# Altium project PC104-M7.PrjPcb (part 1 of 2)
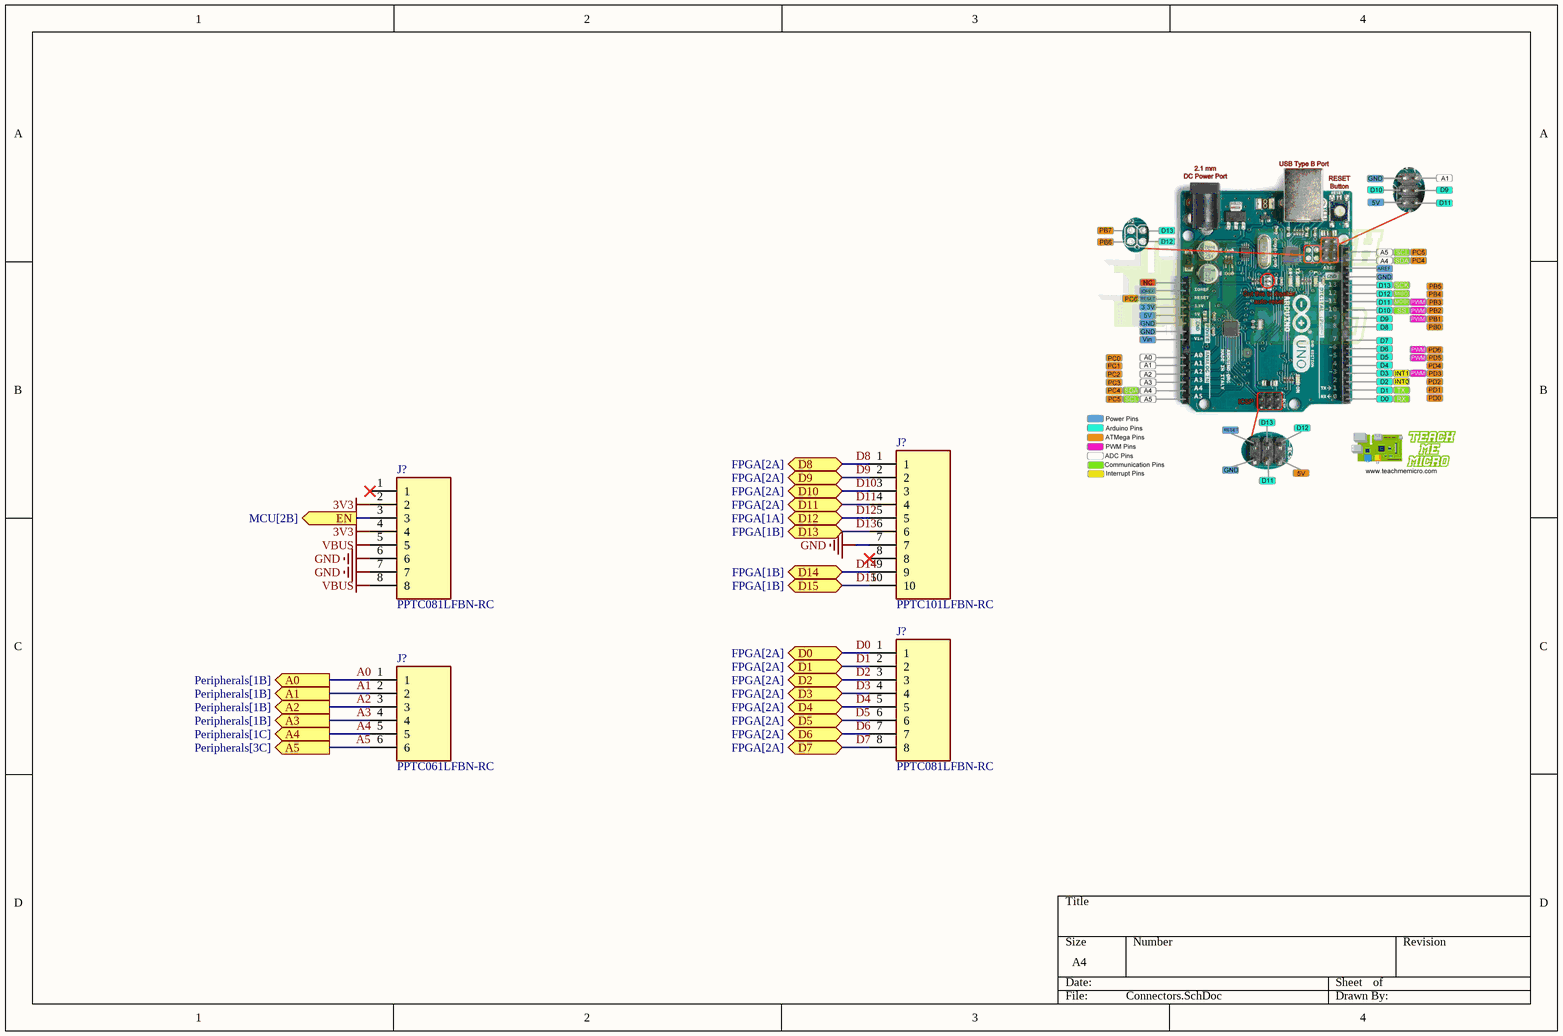
[diagram p0: Connectors.SchDoc]
13 sheets, 147 parts. Net scope: flat (ports and power ports of the same name join across sheets).
Board files: BoardTemplate.PcbDoc, PC104_M7_4L.PcbDoc, PC104-M7_6L.PcbDoc
Sheets:
  Connectors.SchDoc
  GENERAL.SchDoc
    Designator = MCU.SchDoc
    Designator = CAN.SchDoc
    Designator = RS485.SchDoc
    Designator = MemoryStorage.SchDoc
    Designator = TempSensors.SchDoc
    Designator = ExternalConnectors.SchDoc
    Designator = BoardConnectors.SchDoc
    Designator = FPGA.SchDoc
    Designator = RF.SchDoc
    Designator = Power.SchDoc
    Designator = AOCS.SchDoc

## Sheet Connectors.SchDoc
size A4; SheetNumber: 7; SheetTotal: 7

### Parts
(Parts that share a designator on the sheet are numbered #1, #2 ... from top to bottom, then left to right.)
J?#1  PPTC101LFBN-RC  [RHDR10W80P0X254_1X10_2590X254X850P]
J?#2  PPTC081LFBN-RC  [RHDR8W80P0X254_1X8_2082X254X850P]
J?#3  PPTC081LFBN-RC  [RHDR8W80P0X254_1X8_2082X254X850P]
J?#4  PPTC061LFBN-RC  [RHDR6W80P0X254_1X6_1574X254X870P]

### Ports
A0 (out, see Peripherals[1B]), A1 (out, see Peripherals[1B]), A2 (out, see Peripherals[1B]), A3 (out, see Peripherals[1B]), A4 (out, see Peripherals[1C]), A5 (out, see Peripherals[3C]), D0 (bidir, see FPGA[2A]), D1 (bidir, see FPGA[2A]), D2 (bidir, see FPGA[2A]), D3 (bidir, see FPGA[2A]), D4 (bidir, see FPGA[2A]), D5 (bidir, see FPGA[2A]), D6 (bidir, see FPGA[2A]), D7 (bidir, see FPGA[2A]), D8 (bidir, see FPGA[2A]), D9 (bidir, see FPGA[2A]), D10 (bidir, see FPGA[2A]), D11 (bidir, see FPGA[2A]), D12 (bidir, see FPGA[1A]), D13 (bidir, see FPGA[1B]), D14 (bidir, see FPGA[1B]), D15 (bidir, see FPGA[1B]), EN (out, see MCU[2B])

### Nets
3V3: J?#2.2 J?#2.4  [project net PDR_ON]
GND: J?#1.7 J?#2.6 J?#2.7  [project net VSS]
VBUS: J?#2.5 J?#2.8
A0: J?#4.1 ; port A0
A1: J?#4.2 ; port A1
A2: J?#4.3 ; port A2
A3: J?#4.4 ; port A3
A4: J?#4.5 ; port A4
A5: J?#4.6 ; port A5
D0: J?#3.1 ; port D0
D1: J?#3.2 ; port D1
D2: J?#3.3 ; port D2
D3: J?#3.4 ; port D3
D4: J?#3.5 ; port D4
D5: J?#3.6 ; port D5
D6: J?#3.7 ; port D6
D7: J?#3.8 ; port D7
D8: J?#1.1 ; port D8
D9: J?#1.2 ; port D9
D10: J?#1.3 ; port D10
D11: J?#1.4 ; port D11
D12: J?#1.5 ; port D12
D13: J?#1.6 ; port D13
D14: J?#1.9 ; port D14
D15: J?#1.10 ; port D15
NetJ?#2_3: J?#2.3 ; port EN

Not connected (* = marked no-connect by the designer): J?#1 8*; J?#2 1*

### Library data of the parts
J?#1 = PPTC101LFBN-RC: Connector; Manufacturer_Name: Sullins; Datasheet Link: http://www.sullinscorp.com/drawings/78_P(N)PxCxxxLFBN-RC,_10492-H.pdf; Height: 8.5mm; Manufacturer_Part_Number: PPTC101LFBN-RC
J?#2 J?#3 = PPTC081LFBN-RC: Connector; Manufacturer_Name: Sullins; Datasheet Link: http://sullinscorp.com/catalogs/101_PAGE114-115_.100_FEMALE_HDR.pdf; Height: 8.5mm; Manufacturer_Part_Number: PPTC081LFBN-RC
J?#4 = PPTC061LFBN-RC: Connector; Manufacturer_Name: Sullins; Datasheet Link: http://www.sullinscorp.com/drawings/78_P(N)PxCxxxLFBN-RC,_10492-H.pdf; Height: 8.7mm; Manufacturer_Part_Number: PPTC061LFBN-RC

## Sheet GENERAL.SchDoc
size A4; SheetNumber: 1; SheetTotal: 12
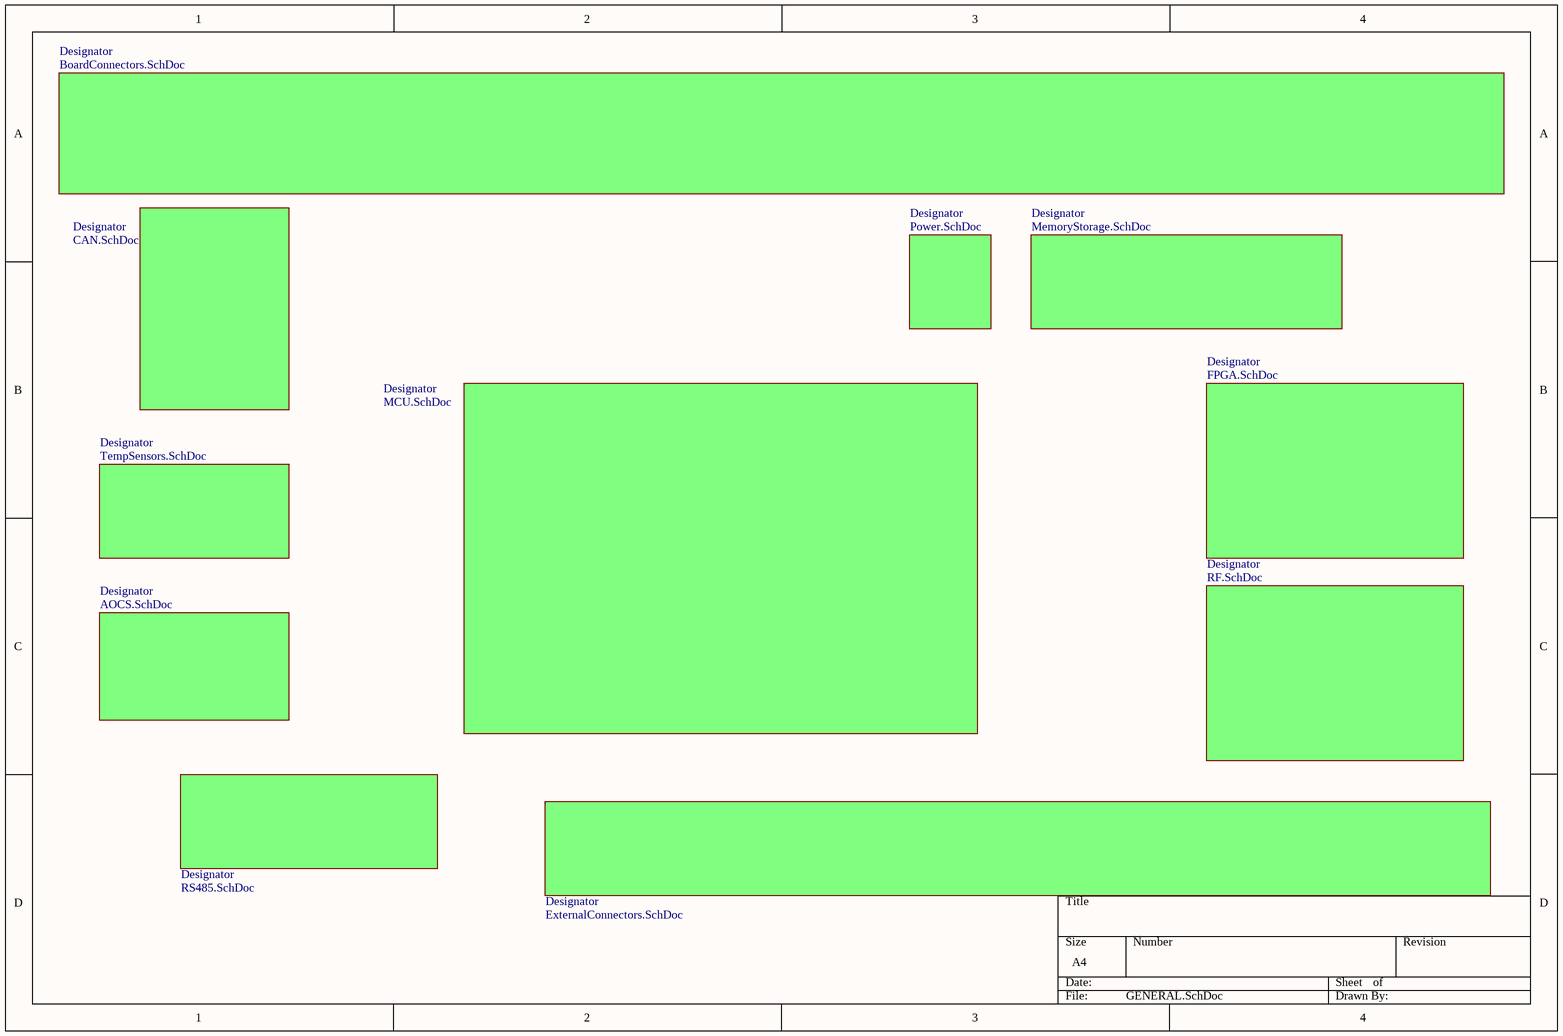
[diagram p1: GENERAL.SchDoc]

### Sub-sheets
Designator = MCU.SchDoc: no entries
Designator = CAN.SchDoc: no entries
Designator = RS485.SchDoc: no entries
Designator = MemoryStorage.SchDoc: no entries
Designator = TempSensors.SchDoc: no entries
Designator = ExternalConnectors.SchDoc: no entries
Designator = BoardConnectors.SchDoc: no entries
Designator = FPGA.SchDoc: no entries
Designator = RF.SchDoc: no entries
Designator = Power.SchDoc: no entries
Designator = AOCS.SchDoc: no entries

## Sheet MCU.SchDoc
size 431 x 279 mm; SheetNumber: 2; SheetTotal: 12; ENG_APP_DATE: --/--/--; DSN_APP_DATE: --/--/--; CHK_APP_DATE: --/--/--
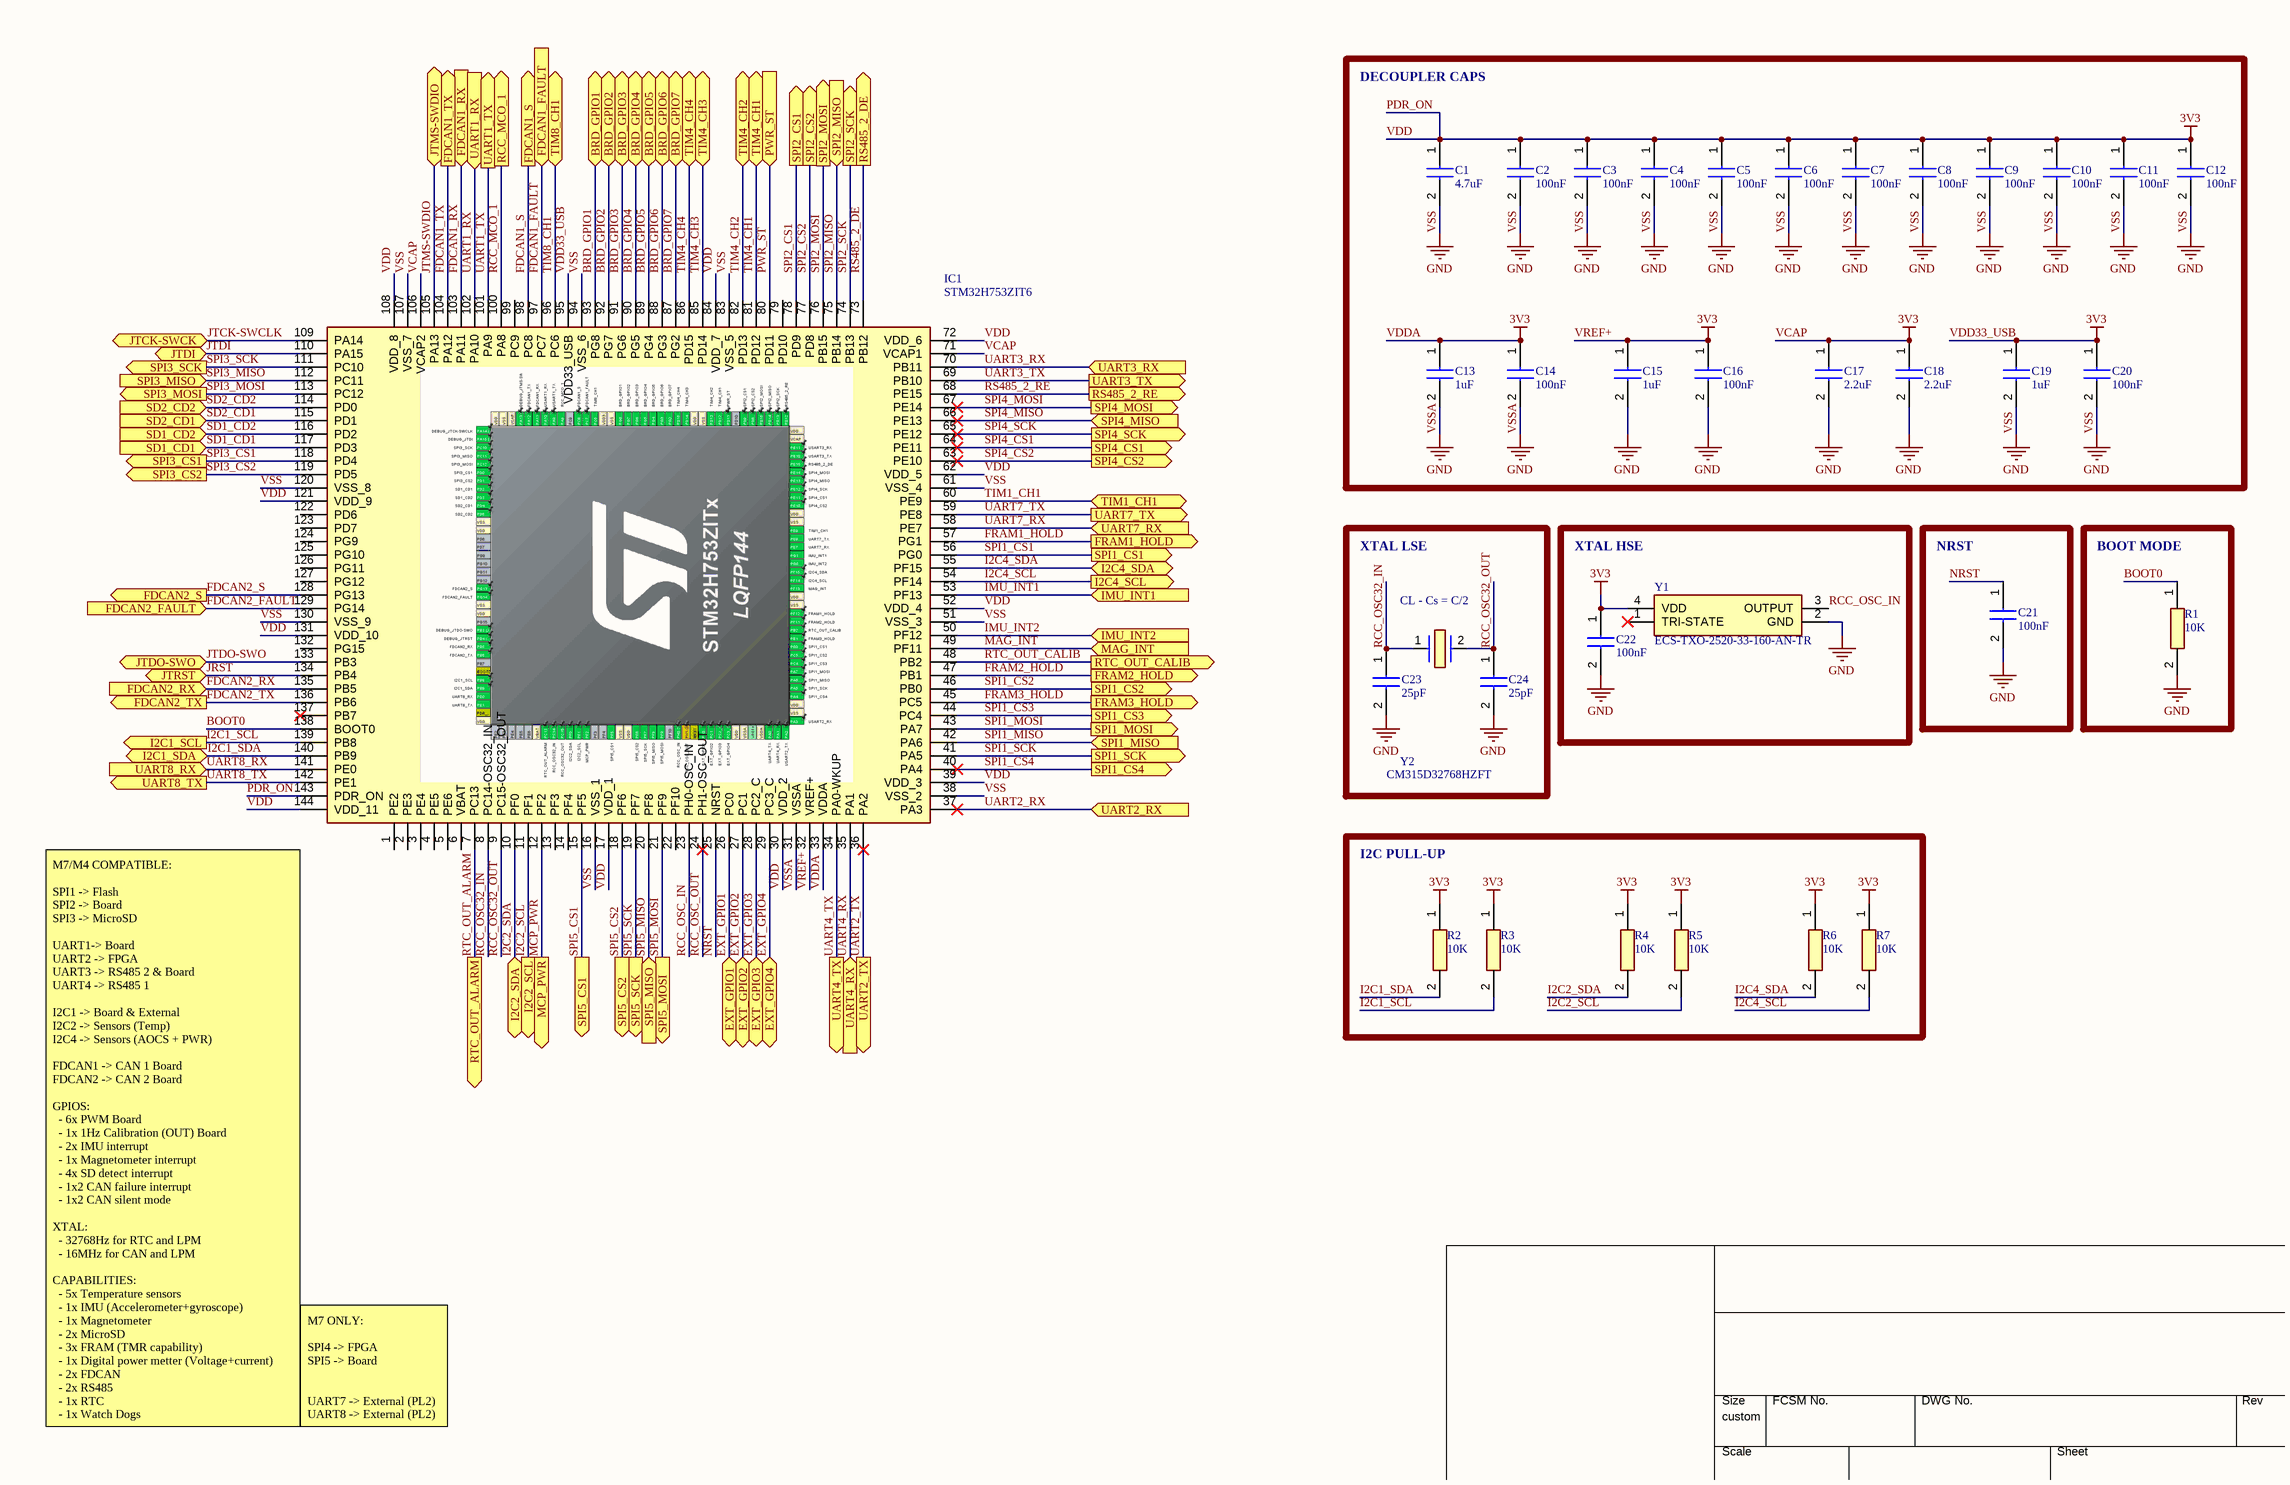
[diagram p2: MCU.SchDoc]

### Parts
C1  4.7uF  [CAPC1608X90N]
C2  100nF  [CAPC1608X95N]
C3  100nF  [CAPC1608X95N]
C4  100nF  [CAPC1608X95N]
C5  100nF  [CAPC1608X95N]
C6  100nF  [CAPC1608X95N]
C7  100nF  [CAPC1608X95N]
C8  100nF  [CAPC1608X95N]
C9  100nF  [CAPC1608X95N]
C10  100nF  [CAPC1608X95N]
C11  100nF  [CAPC1608X95N]
C12  100nF  [CAPC1608X95N]
C13  1uF  [CAPC1608X90N]
C14  100nF  [CAPC1608X95N]
C15  1uF  [CAPC1608X90N]
C16  100nF  [CAPC1608X95N]
C17  2.2uF  [CAPC1608X90N]
C18  2.2uF  [CAPC1608X90N]
C19  1uF  [CAPC1608X90N]
C20  100nF  [CAPC1608X95N]
C21  100nF  [CAPC1608X95N]
C22  100nF  [CAPC1608X95N]
C23  25pF  [CAPC1608X90N]
C24  25pF  [CAPC1608X90N]
IC1  STM32H753ZIT6  [QFP50P2200X2200X160-144N]
R1  10K  [RESC1508X50N]
R2  10K  [RESC1508X50N]
R3  10K  [RESC1508X50N]
R4  10K  [RESC1508X50N]
R5  10K  [RESC1508X50N]
R6  10K  [RESC1508X50N]
R7  10K  [RESC1508X50N]
Y1  ECS-TXO-2520-33-160-AN-TR  [ECSTXO252033160ANTR]
Y2  CM315D32768HZFT  [CM315D32768HZFT]

### Blocks framed on the sheet
DECOUPLER CAPS: C1-C20
XTAL LSE: C23 C24 Y2
XTAL HSE: C22 Y1
NRST: C21
BOOT MODE: R1
I2C PULL-UP: R2-R7

### Ports
BRD_GPIO1 (bidir), BRD_GPIO2 (bidir), BRD_GPIO3 (bidir), BRD_GPIO4 (bidir), BRD_GPIO5 (bidir), BRD_GPIO6 (bidir), BRD_GPIO7 (bidir), EXT_GPIO1 (bidir), EXT_GPIO2 (bidir), EXT_GPIO3 (bidir), EXT_GPIO4 (bidir), FDCAN1_FAULT (in), FDCAN1_RX (in), FDCAN1_S (out), FDCAN1_TX (out), FDCAN2_FAULT (in), FDCAN2_RX (in), FDCAN2_S (out), FDCAN2_TX (out), FRAM1_HOLD (out), FRAM2_HOLD (out), FRAM3_HOLD (out), I2C1_SCL (out), I2C1_SDA (bidir), I2C2_SCL (out), I2C2_SDA (bidir), I2C4_SCL (out), I2C4_SDA (bidir), IMU_INT1 (in), IMU_INT2 (in), JTCK-SWCK (bidir), JTDI (bidir), JTDO-SWO (bidir), JTMS-SWDIO (bidir), JTRST (bidir), MAG_INT (in), MCP_PWR (out), PWR_ST (in), RCC_MCO_1 (out), RS485_2_DE (out), RS485_2_RE (out), RTC_OUT_ALARM (out), RTC_OUT_CALIB (out), SD1_CD1 (in), SD1_CD2 (in), SD2_CD1 (in), SD2_CD2 (in), SPI1_CS1 (out), SPI1_CS2 (out), SPI1_CS3 (out), SPI1_CS4 (out), SPI1_MISO (in), SPI1_MOSI (out), SPI1_SCK (out), SPI2_CS1 (out), SPI2_CS2 (out), SPI2_MISO (in), SPI2_MOSI (out), SPI2_SCK (out), SPI3_CS1 (out), SPI3_CS2 (out), SPI3_MISO (in), SPI3_MOSI (out), SPI3_SCK (out), SPI4_CS1 (out), SPI4_CS2 (out), SPI4_MISO (in), SPI4_MOSI (out), SPI4_SCK (out), SPI5_CS1 (out), SPI5_CS2 (out), SPI5_MISO (in), SPI5_MOSI (out), SPI5_SCK (out), TIM1_CH1 (bidir), TIM4_CH1 (bidir), TIM4_CH2 (bidir), TIM4_CH3 (bidir), TIM4_CH4 (bidir), TIM8_CH1 (bidir), UART1_RX (in), UART1_TX (out), UART2_RX (in), UART2_TX (out), UART3_RX (in), UART3_TX (out), UART4_RX (in), UART4_TX (out), UART7_RX (in), UART7_TX (out), UART8_RX (in), UART8_TX (out)

### Nets
PDR_ON: C1.1 C2.1 C3.1 C4.1 C5.1 C6.1 C7.1 C8.1 C9.1 C10.1 C11.1 C12.1 C13.1 C14.1 C15.1 C16.1 C17.1 C18.1 C19.1 C20.1 C22.1 IC1.17(VDD_1) IC1.30(VDD_2) IC1.32(VREF+) IC1.33(VDDA) IC1.39(VDD_3) IC1.52(VDD_4) IC1.62(VDD_5) IC1.71(VCAP1) IC1.72(VDD_6) IC1.84(VDD_7) IC1.95(VDD33_USB) IC1.106(VCAP2) IC1.108(VDD_8) IC1.121(VDD_9) IC1.131(VDD_10) IC1.143(PDR_ON) IC1.144(VDD_11) R2.1 R3.1 R4.1 R5.1 R6.1 R7.1 Y1.4(VDD)  [also labelled 3V3, VCAP, VDD, VDD33_USB, VDDA, VREF+]
VSS: C1.2 C2.2 C3.2 C4.2 C5.2 C6.2 C7.2 C8.2 C9.2 C10.2 C11.2 C12.2 C13.2 C14.2 C15.2 C16.2 C17.2 C18.2 C19.2 C20.2 C21.2 C22.2 C23.2 C24.2 IC1.16(VSS_1) IC1.31(VSSA) IC1.38(VSS_2) IC1.51(VSS_3) IC1.61(VSS_4) IC1.83(VSS_5) IC1.94(VSS_6) IC1.107(VSS_7) IC1.120(VSS_8) IC1.130(VSS_9) R1.2 Y1.2(GND)  [also labelled GND, VSSA]
BOOT0: IC1.138(BOOT0) R1.1
BRD_GPIO1: IC1.93(PG8) ; port BRD_GPIO1
BRD_GPIO2: IC1.92(PG7) ; port BRD_GPIO2
BRD_GPIO3: IC1.91(PG6) ; port BRD_GPIO3
BRD_GPIO4: IC1.90(PG5) ; port BRD_GPIO4
BRD_GPIO5: IC1.89(PG4) ; port BRD_GPIO5
BRD_GPIO6: IC1.88(PG3) ; port BRD_GPIO6
BRD_GPIO7: IC1.87(PG2) ; port BRD_GPIO7
EXT_GPIO1: IC1.26(PC0) ; port EXT_GPIO1
EXT_GPIO2: IC1.27(PC1) ; port EXT_GPIO2
EXT_GPIO3: IC1.28(PC2_C) ; port EXT_GPIO3
EXT_GPIO4: IC1.29(PC3_C) ; port EXT_GPIO4
FDCAN1_FAULT: IC1.97(PC7) ; port FDCAN1_FAULT
FDCAN1_RX: IC1.103(PA11) ; port FDCAN1_RX
FDCAN1_S: IC1.98(PC8) ; port FDCAN1_S
FDCAN1_TX: IC1.104(PA12) ; port FDCAN1_TX
FDCAN2_FAULT: IC1.129(PG14) ; port FDCAN2_FAULT
FDCAN2_RX: IC1.135(PB5) ; port FDCAN2_RX
FDCAN2_S: IC1.128(PG13) ; port FDCAN2_S
FDCAN2_TX: IC1.136(PB6) ; port FDCAN2_TX
FRAM1_HOLD: IC1.57(PG1) ; port FRAM1_HOLD
FRAM2_HOLD: IC1.47(PB1) ; port FRAM2_HOLD
FRAM3_HOLD: IC1.45(PC5) ; port FRAM3_HOLD
I2C1_SCL: IC1.139(PB8) R3.2 ; port I2C1_SCL
I2C1_SDA: IC1.140(PB9) R2.2 ; port I2C1_SDA
I2C2_SCL: IC1.11(PF1) R5.2 ; port I2C2_SCL
I2C2_SDA: IC1.10(PF0) R4.2 ; port I2C2_SDA
I2C4_SCL: IC1.54(PF14) R7.2 ; port I2C4_SCL
I2C4_SDA: IC1.55(PF15) R6.2 ; port I2C4_SDA
IMU_INT1: IC1.53(PF13) ; port IMU_INT1
IMU_INT2: IC1.50(PF12) ; port IMU_INT2
JRST: IC1.134(PB4) ; port JTRST
JTCK-SWCLK: IC1.109(PA14) ; port JTCK-SWCK
JTDI: IC1.110(PA15) ; port JTDI
JTDO-SWO: IC1.133(PB3) ; port JTDO-SWO
JTMS-SWDIO: IC1.105(PA13) ; port JTMS-SWDIO
MAG_INT: IC1.49(PF11) ; port MAG_INT
MCP_PWR: IC1.12(PF2) ; port MCP_PWR
NRST: C21.1 IC1.25(NRST)
PWR_ST: IC1.80(PD11) ; port PWR_ST
RCC_MCO_1: IC1.100(PA8) ; port RCC_MCO_1
RCC_OSC32_IN: C23.1 IC1.8(PC14-OSC32_IN) Y2.1
RCC_OSC32_OUT: C24.1 IC1.9(PC15-OSC32_OUT) Y2.2
RCC_OSC_IN: IC1.23(PH0-OSC_IN) Y1.3(OUTPUT)
RCC_OSC_OUT: IC1.24(PH1-OSC_OUT)
RS485_2_DE: IC1.73(PB12) ; port RS485_2_DE
RS485_2_RE: IC1.68(PE15) ; port RS485_2_RE
RTC_OUT_ALARM: IC1.7(PC13) ; port RTC_OUT_ALARM
RTC_OUT_CALIB: IC1.48(PB2) ; port RTC_OUT_CALIB
SD1_CD1: IC1.117(PD3) ; port SD1_CD1
SD1_CD2: IC1.116(PD2) ; port SD1_CD2
SD2_CD1: IC1.115(PD1) ; port SD2_CD1
SD2_CD2: IC1.114(PD0) ; port SD2_CD2
SPI1_CS1: IC1.56(PG0) ; port SPI1_CS1
SPI1_CS2: IC1.46(PB0) ; port SPI1_CS2
SPI1_CS3: IC1.44(PC4) ; port SPI1_CS3
SPI1_CS4: IC1.40(PA4) ; port SPI1_CS4
SPI1_MISO: IC1.42(PA6) ; port SPI1_MISO
SPI1_MOSI: IC1.43(PA7) ; port SPI1_MOSI
SPI1_SCK: IC1.41(PA5) ; port SPI1_SCK
SPI2_CS1: IC1.78(PD9) ; port SPI2_CS1
SPI2_CS2: IC1.77(PD8) ; port SPI2_CS2
SPI2_MISO: IC1.75(PB14) ; port SPI2_MISO
SPI2_MOSI: IC1.76(PB15) ; port SPI2_MOSI
SPI2_SCK: IC1.74(PB13) ; port SPI2_SCK
SPI3_CS1: IC1.118(PD4) ; port SPI3_CS1
SPI3_CS2: IC1.119(PD5) ; port SPI3_CS2
SPI3_MISO: IC1.112(PC11) ; port SPI3_MISO
SPI3_MOSI: IC1.113(PC12) ; port SPI3_MOSI
SPI3_SCK: IC1.111(PC10) ; port SPI3_SCK
SPI4_CS1: IC1.64(PE11) ; port SPI4_CS1
SPI4_CS2: IC1.63(PE10) ; port SPI4_CS2
SPI4_MISO: IC1.66(PE13) ; port SPI4_MISO
SPI4_MOSI: IC1.67(PE14) ; port SPI4_MOSI
SPI4_SCK: IC1.65(PE12) ; port SPI4_SCK
SPI5_CS1: IC1.15(PF5) ; port SPI5_CS1
SPI5_CS2: IC1.18(PF6) ; port SPI5_CS2
SPI5_MISO: IC1.20(PF8) ; port SPI5_MISO
SPI5_MOSI: IC1.21(PF9) ; port SPI5_MOSI
SPI5_SCK: IC1.19(PF7) ; port SPI5_SCK
TIM1_CH1: IC1.60(PE9) ; port TIM1_CH1
TIM4_CH1: IC1.81(PD12) ; port TIM4_CH1
TIM4_CH2: IC1.82(PD13) ; port TIM4_CH2
TIM4_CH3: IC1.85(PD14) ; port TIM4_CH3
TIM4_CH4: IC1.86(PD15) ; port TIM4_CH4
TIM8_CH1: IC1.96(PC6) ; port TIM8_CH1
UART1_RX: IC1.102(PA10) ; port UART1_RX
UART1_TX: IC1.101(PA9) ; port UART1_TX
UART2_RX: IC1.37(PA3) ; port UART2_RX
UART2_TX: IC1.36(PA2) ; port UART2_TX
UART3_RX: IC1.70(PB11) ; port UART3_RX
UART3_TX: IC1.69(PB10) ; port UART3_TX
UART4_RX: IC1.35(PA1) ; port UART4_RX
UART4_TX: IC1.34(PA0-WKUP) ; port UART4_TX
UART7_RX: IC1.58(PE7) ; port UART7_RX
UART7_TX: IC1.59(PE8) ; port UART7_TX
UART8_RX: IC1.141(PE0) ; port UART8_RX
UART8_TX: IC1.142(PE1) ; port UART8_TX

Not connected (* = marked no-connect by the designer): IC1 1(PE2) 2(PE3) 3(PE4) 4(PE5) 5(PE6) 6(VBAT) 13(PF3) 14(PF4) 22(PF10) 79(PD10) 99(PC9) 122(PD6) 123(PD7) 124(PG9) 125(PG10) 126(PG11) 127(PG12) 132(PG15) 137(PB7)*; Y1 1(TRI-STATE)*

### Notes on the sheet
- (near Y2) CL - Cs = C/2
- (near IC1) M7/M4 COMPATIBLE:
  SPI1 -> Flash
  SPI2 -> Board
  SPI3 -> MicroSD
  UART1-> Board
  UART2 -> FPGA
  UART3 -> RS485 2 & Board
  UART4 -> RS485 1
  I2C1 -> Board & External
  I2C2 -> Sensors (Temp)
  I2C4 -> Sensors (AOCS + PWR)
  FDCAN1 -> CAN 1 Board
  FDCAN2 -> CAN 2 Board
  GPIOS:
  - 6x PWM Board
  - 1x 1Hz Calibration (OUT) Board
  - 2x IMU interrupt
  - 1x Magnetometer interrupt
  - 4x SD detect interrupt
  - 1x2 CAN failure interrupt
  - 1x2 CAN silent mode
  XTAL:
  - 32768Hz for RTC and LPM
  - 16MHz for CAN and LPM
  CAPABILITIES:
  - 5x Temperature sensors
  - 1x IMU (Accelerometer+gyroscope)
  - 1x Magnetometer
  - 2x MicroSD
  - 3x FRAM (TMR capability)
  - 1x Digital power metter (Voltage+current)
  - 2x FDCAN
  - 2x RS485
  - 1x RTC
  - 1x Watch Dogs
- M7 ONLY:
  SPI4 -> FPGA
  SPI5 -> Board
  UART7 -> External (PL2)
  UART8 -> External (PL2)
- DWG. NO.
- REV.
- SHT.
- THIS DOCUMENT AND THE DATA DISCLOSED HEREIN OR HEREWITH IS THE PROPERTY OF ALTIUM LIMITED AND MAY BE FREELY DISTRIBUTED IN WHOLE. NO RIGHTS ARE RESERVED OR EXPRESS OR IMPLIED WARANTEE GIVEN.
- REVISION
- DESCRIPTION
- DATE
- APPROVED
- ENG:
- APPROVALS
- PROJECT
- DSN:
- CHK:
- REFERENCE DOCUMENTS
- PROJECT REVISION:
- TITLE
- DOCUMENT REVISION:
- DESIGN ITEM:
- BOM:
- FAB DWG:
- PCB DWG:
- ASSY DWG:
- SCALE:
- SIZE
- B
- CAGE CODE
- FILE NAME
- DWG NO.
- SHEET
- OF
- REV

### Library data of the parts
C1 = CL10A475KP8NNNC: 4.7 µF ±10% 10V Ceramic Capacitor X5R 0603 (1608 Metric); Manufacturer_Name: SAMSUNG; Datasheet Link: https://www.arrow.com/en/products/cl10a475kp8nnnc/samsung-electro-mechanics; Height: 0.9mm; Manufacturer_Part_Number: CL10A475KP8NNNC; Mouser Part Number: 187-CL10A475KP8NNNC; Mouser Price/Stock: https://www.mouser.co.uk/ProductDetail/Samsung-Electro-Mechanics/CL10A475KP8NNNC?qs=hqM3L16%252BxlfQRmkWsZz5vA%3D%3D; Arrow Part Number: CL10A475KP8NNNC; Arrow Price/Stock: https://www.arrow.com/en/products/cl10a475kp8nnnc/samsung-electro-mechanics?region=europe
C2-C12 C14 C16 C20-C22 = C0603C104M4RAC7867: 0.1 µF ±20% 16V Ceramic Capacitor X7R 0603 (1608 Metric); Manufacturer_Name: KEMET; Datasheet Link: https://www.arrow.com/en/products/c0603c104m4rac7867/kemet-corporation?region=nac; Height: 0.95mm; Manufacturer_Part_Number: C0603C104M4RAC7867; Mouser Part Number: N/A; Mouser Price/Stock: https://www.mouser.co.uk/ProductDetail/KEMET/C0603C104M4RAC7867?qs=nAEW9fCjKd%252BI998RVtZhZQ%3D%3D; Arrow Part Number: C0603C104M4RAC7867; Arrow Price/Stock: https://www.arrow.com/en/products/c0603c104m4rac7867/kemet-corporation?region=europe
C13 C15 C19 = CL10A105KA8NNNC: 1 µF ±10% 25V Ceramic Capacitor X5R 0603 (1608 Metric); Manufacturer_Name: SAMSUNG; Datasheet Link: http://uk.rs-online.com/web/p/products/7664838; Height: 0.9mm; Manufacturer_Part_Number: CL10A105KA8NNNC; Mouser Part Number: 187-CL10A105KA8NNNC; Mouser Price/Stock: https://www.mouser.co.uk/ProductDetail/Samsung-Electro-Mechanics/CL10A105KA8NNNC?qs=hqM3L16%252BxldY%252BnK4KzDJVg%3D%3D; Arrow Part Number: CL10A105KA8NNNC; Arrow Price/Stock: https://www.arrow.com/en/products/cl10a105ka8nnnc/samsung-electro-mechanics?region=europe
C17 C18 = CL10A225KO8NNNC: 2.2 µF ±10% 16V Ceramic Capacitor X5R 0603 (1608 Metric); Manufacturer_Name: SAMSUNG; Datasheet Link: https://lcsc.componentsearchengine.com/Datasheets/2/CL10A225KO8NNNC.pdf; Height: 0.9mm; Manufacturer_Part_Number: CL10A225KO8NNNC; Mouser Part Number: 187-CL10A225KO8NNNC; Mouser Price/Stock: https://www.mouser.co.uk/ProductDetail/Samsung-Electro-Mechanics/CL10A225KO8NNNC?qs=hqM3L16%252BxlecoJxUp5hKOw%3D%3D; Arrow Part Number: CL10A225KO8NNNC; Arrow Price/Stock: https://www.arrow.com/en/products/cl10a225ko8nnnc/samsung-electro-mechanics?region=nac
C23 C24 = GCM1885C2A220FA16D: 22 pF ±1% 100V Ceramic Capacitor C0G, NP0 0603 (1608 Metric); Manufacturer_Name: Murata Electronics; Datasheet Link: https://www.murata.com/en-global/api/pdfdownloadapi?cate=luCeramicCapacitorsSMD&partno=GCM1885C2A220FA16%23; Height: 0.9mm; Manufacturer_Part_Number: GCM1885C2A220FA16D
IC1 = STM32H753ZIT6: ARM® Cortex®-M7 STM32H7 Microcontroller IC 32-Bit Single-Core 480MHz 2MB (2M x 8) FLASH 144-LQFP (20x20); Manufacturer_Name: STMicroelectronics; Datasheet Link: http://www.st.com/content/ccc/resource/technical/document/datasheet/group3/01/21/00/39/12/c9/4c/f1/DM00388325/files/DM00388325.pdf/jcr:content/translations/en.DM00388325.pdf; Height: 1.6mm; Manufacturer_Part_Number: STM32H753ZIT6; Mouser Part Number: 511-STM32H753ZIT6; Mouser Price/Stock: https://www.mouser.co.uk/ProductDetail/STMicroelectronics/STM32H753ZIT6?qs=u4fy%2FsgLU9PzR9vtNNw%2FMw%3D%3D; Arrow Part Number: STM32H753ZIT6; Arrow Price/Stock: https://www.arrow.com/en/products/stm32h753zit6/stmicroelectronics?region=nac
R1-R7 = RNCP0603FTD10K0: 10 kOhms ±1% 0.125W, 1/8W Chip Resistor 0603 (1608 Metric) Anti-Sulfur Thin Film; Manufacturer_Name: Stackpole Electronics; Datasheet Link: https://cs.seielect.com/catalog/SEI-RNCP.pdf; Height: 0.5mm; Manufacturer_Part_Number: RNCP0603FTD10K0; Mouser Part Number: 708-RNCP0603FTD10K0; Mouser Price/Stock: https://www.mouser.co.uk/ProductDetail/SEI-Stackpole/RNCP0603FTD10K0?qs=FESYatJ8odL1jmHQSpKOPg%3D%3D; Arrow Part Number: RNCP0603FTD10K0; Arrow Price/Stock: https://www.arrow.com/en/products/rncp0603ftd10k0/stackpole-electronics?region=nac
Y1 = ECS-TXO-2520-33-160-AN-TR: 16 MHz TCXO HCMOS Oscillator 3.3V Enable/Disable 4-SMD, No Lead; Manufacturer_Name: ECS; Datasheet Link: https://ecsxtal.com/store/pdf/ECS-TXO-2520.pdf; Height: 1mm; Manufacturer_Part_Number: ECS-TXO-2520-33-160-AN-TR; Mouser Part Number: 520-T2520-33-160-ANT; Mouser Price/Stock: https://www.mouser.co.uk/ProductDetail/ECS/ECS-TXO-2520-33-160-AN-TR?qs=KAq9QXcE8HAE1gcf2ozR9w%3D%3D; Arrow Part Number: ECS-TXO-2520-33-160-AN-TR; Arrow Price/Stock: https://www.arrow.com/en/products/ecs-txo-2520-33-160-an-tr/ecs-international?region=nac
Y2 = CM315D32768HZFT: 32.768 kHz ±5ppm Crystal 12.5pF 70 kOhms 2-SMD, No Lead; Manufacturer_Name: CITIZEN FINEDEVICE; Datasheet Link: http://cfd.citizen.co.jp/cms/cfd/pdf/english/CM315D_E.pdf; Height: 0.9mm; Manufacturer_Part_Number: CM315D32768HZFT; Mouser Part Number: N/A; Mouser Price/Stock: https://www.mouser.co.uk/ProductDetail/Citizen-FineDevice/CM315D32768HZFT?qs=wnTfsH77Xs4JnKs4SU5%252Bgw%3D%3D

## Sheet CAN.SchDoc
size A4; SheetNumber: 5; SheetTotal: 12
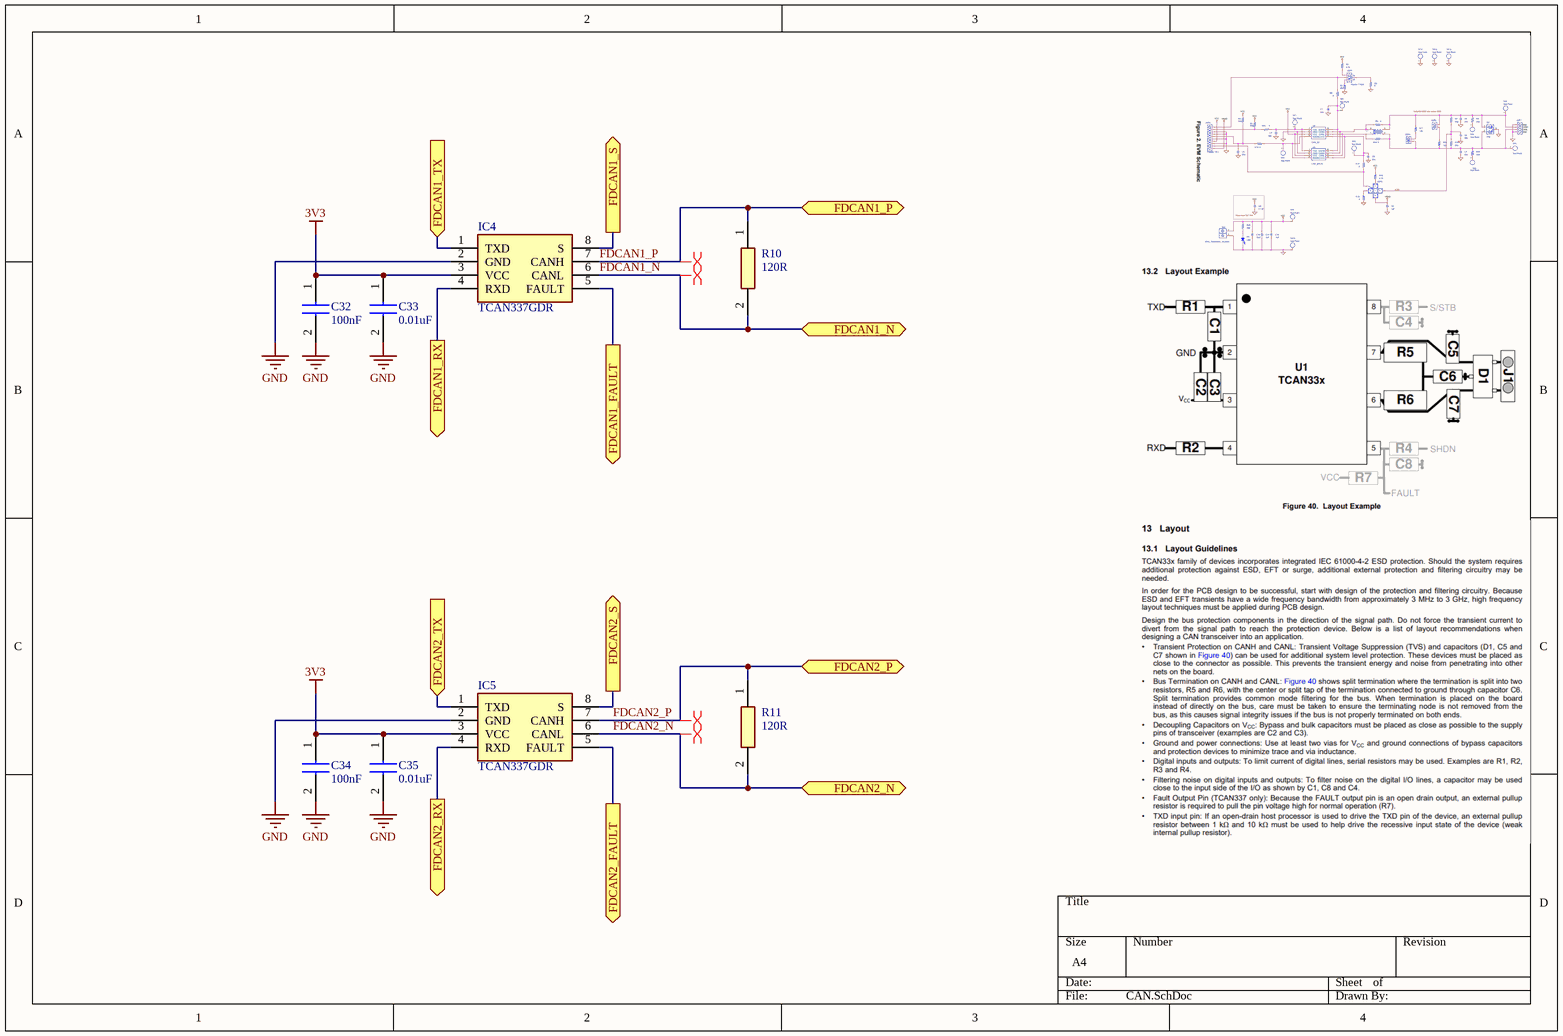
[diagram p3: CAN.SchDoc]

### Parts
C32  100nF  [CAPC1608X95N]
C33  0.01uF  [C0603]
C34  100nF  [CAPC1608X95N]
C35  0.01uF  [C0603]
IC4  TCAN337GDR  [SOIC127P600X175-8N]
IC5  TCAN337GDR  [SOIC127P600X175-8N]
R10  120R  [ERA6VK]
R11  120R  [ERA6VK]

### Ports
FDCAN1_FAULT (out), FDCAN1_N (bidir), FDCAN1_P (bidir), FDCAN1_RX (out), FDCAN1_S (out), FDCAN1_TX (in), FDCAN2_FAULT (out), FDCAN2_N (bidir), FDCAN2_P (bidir), FDCAN2_RX (out), FDCAN2_S (out), FDCAN2_TX (in)

### Nets
3V3: C32.1 C33.1 C34.1 C35.1 IC4.3(VCC) IC5.3(VCC)  [project net PDR_ON]
GND: C32.2 C33.2 C34.2 C35.2 IC4.2(GND) IC5.2(GND)  [project net VSS]
FDCAN1_FAULT: IC4.5(FAULT) ; port FDCAN1_FAULT
FDCAN1_N: IC4.6(CANL) R10.2 ; port FDCAN1_N
FDCAN1_P: IC4.7(CANH) R10.1 ; port FDCAN1_P
FDCAN1_RX: IC4.4(RXD) ; port FDCAN1_RX
FDCAN1_S: IC4.8(S) ; port FDCAN1_S
FDCAN1_TX: IC4.1(TXD) ; port FDCAN1_TX
FDCAN2_FAULT: IC5.5(FAULT) ; port FDCAN2_FAULT
FDCAN2_N: IC5.6(CANL) R11.2 ; port FDCAN2_N
FDCAN2_P: IC5.7(CANH) R11.1 ; port FDCAN2_P
FDCAN2_RX: IC5.4(RXD) ; port FDCAN2_RX
FDCAN2_S: IC5.8(S) ; port FDCAN2_S
FDCAN2_TX: IC5.1(TXD) ; port FDCAN2_TX

### Layout directives
differential pair: FDCAN1_N, FDCAN1_P, FDCAN2_N, FDCAN2_P

### Library data of the parts
C32 C34 = C0603C104M4RAC7867: as C2 on sheet MCU; Datasheet Link: https://www.arrow.com/en/products/c0603c104m4rac7867/kemet-corporation?region=nac; Height: 0.95mm; Manufacturer_Part_Number: C0603C104M4RAC7867; Mouser Part Number: N/A; Mouser Price/Stock: https://www.mouser.co.uk/ProductDetail/KEMET/C0603C104M4RAC7867?qs=nAEW9fCjKd%252BI998RVtZhZQ%3D%3D; Arrow Part Number: C0603C104M4RAC7867; Arrow Price/Stock: https://www.arrow.com/en/products/c0603c104m4rac7867/kemet-corporation?region=europe
C33 C35 = C0603C103KMRECAUTO: 10000 pF ±10% 63V Ceramic Capacitor X7R 0603 (1608 Metric); Manufacturer_Name: KEMET; Datasheet Link: https://content.kemet.com/datasheets/KEM_C1090_X7R_ESD.pdf; Height: 0.87mm; Manufacturer_Part_Number: C0603C103KMRECAUTO; Mouser Part Number: 80-C0603C103KMREAUTO; Mouser Price/Stock: https://www.mouser.co.uk/ProductDetail/KEMET/C0603C103KMRECAUTO?qs=u4fy%2FsgLU9P0r6p3bzZgfw%3D%3D; Arrow Part Number: C0603C103KMRECAUTO; Arrow Price/Stock: https://www.arrow.com/en/products/c0603c103kmrecauto/kemet-corporation?region=nac
IC4 IC5 = TCAN337GDR: 1/1 Transceiver CANbus 8-SOIC; Manufacturer_Name: Texas Instruments; Datasheet Link: http://www.ti.com/lit/gpn/tcan337g; Height: 1.75mm; Manufacturer_Part_Number: TCAN337GDR; Mouser Part Number: 595-TCAN337GDR; Mouser Price/Stock: https://www.mouser.co.uk/ProductDetail/Texas-Instruments/TCAN337GDR?qs=gMfM3zrbS4qJ%252BEWbPaeUtA%3D%3D; Arrow Part Number: TCAN337GDR; Arrow Price/Stock: https://www.arrow.com/en/products/tcan337gdr/texas-instruments?region=nac
R10 R11 = ERA-6VEB1200V: 120 Ohms ±0.1% 0.25W, 1/4W Chip Resistor 0805 (2012 Metric) Anti-Sulfur, Automotive AEC-Q200 Thin Film; Manufacturer_Name: Panasonic; Datasheet Link: http://industrial.panasonic.com/cdbs/www-data/pdf/RDM0000/RDM0000C331.pdf; Height: 0.65mm; Manufacturer_Part_Number: ERA-6VEB1200V; Mouser Part Number: 667-ERA-6VEB1200V; Mouser Price/Stock: https://www.mouser.co.uk/ProductDetail/Panasonic/ERA-6VEB1200V?qs=rI7uf1IzohQDwVDMjI%252BQDA%3D%3D; Arrow Part Number: ERA-6VEB1200V; Arrow Price/Stock: https://www.arrow.com/en/products/era-6veb1200v/panasonic?region=nac

## Sheet RS485.SchDoc
size A4; SheetNumber: 9; SheetTotal: 12
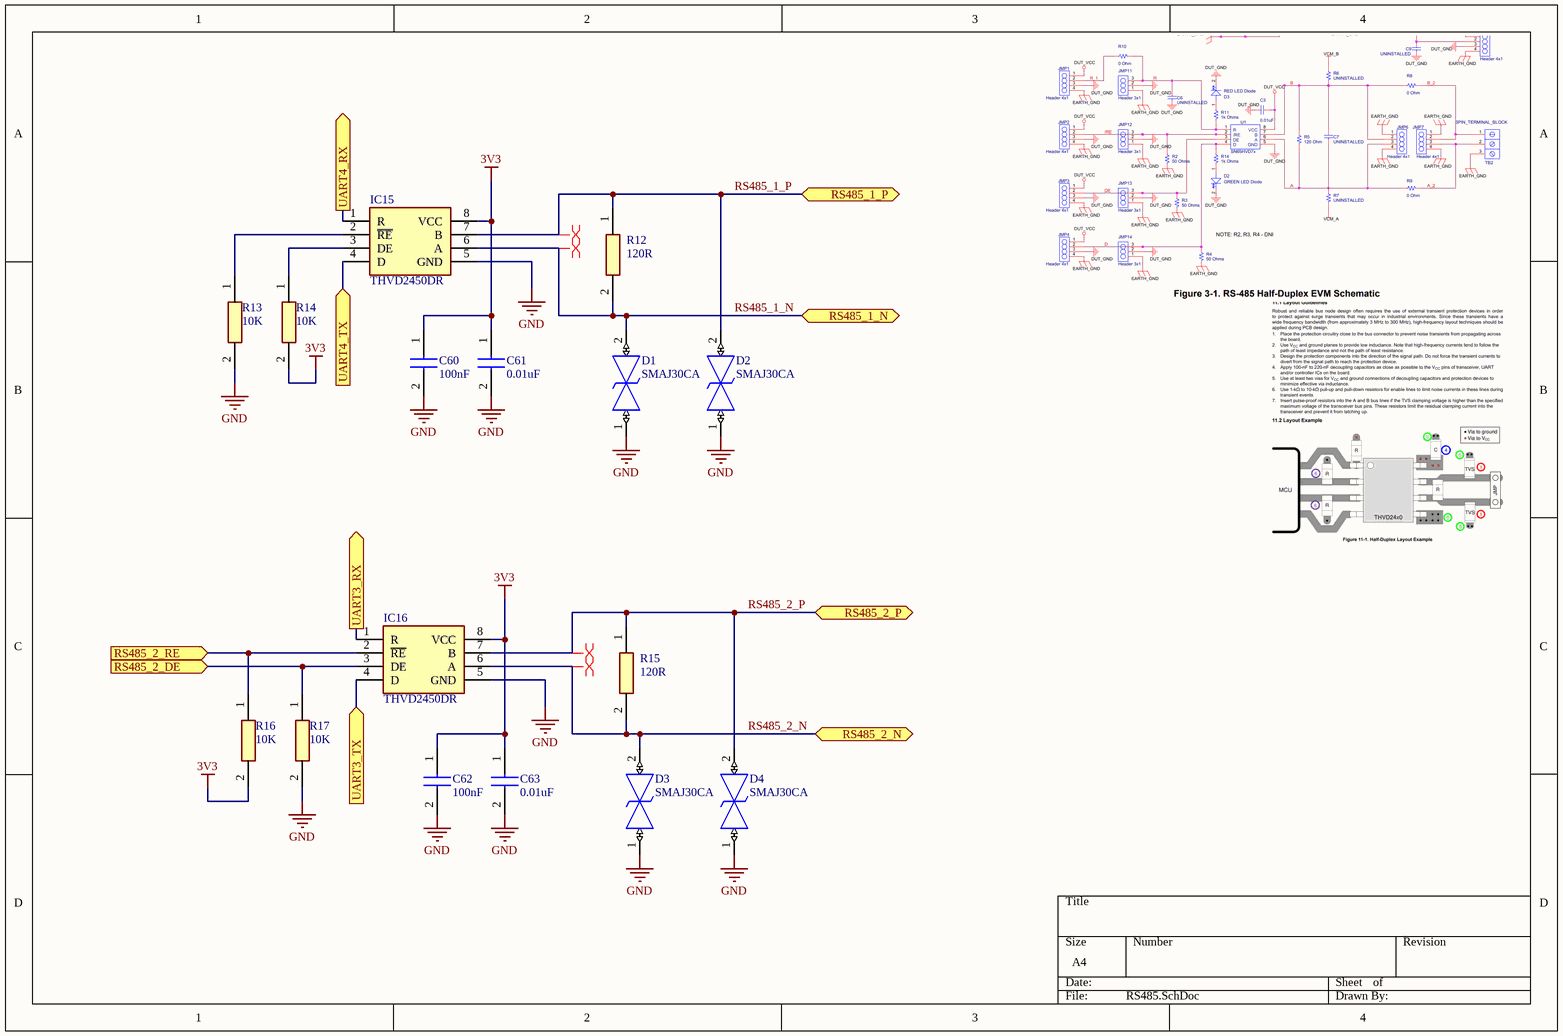
[diagram p4: RS485.SchDoc]

### Parts
C60  100nF  [CAPC1608X95N]
C61  0.01uF  [C0603]
C62  100nF  [CAPC1608X95N]
C63  0.01uF  [C0603]
D1  SMAJ30CA  [DIONM5026X229N]
D2  SMAJ30CA  [DIONM5026X229N]
D3  SMAJ30CA  [DIONM5026X229N]
D4  SMAJ30CA  [DIONM5026X229N]
IC15  THVD2450DR  [SOIC127P600X175-8N]
IC16  THVD2450DR  [SOIC127P600X175-8N]
R12  120R  [ERA6VK]
R13  10K  [RESC1508X50N]
R14  10K  [RESC1508X50N]
R15  120R  [ERA6VK]
R16  10K  [RESC1508X50N]
R17  10K  [RESC1508X50N]

### Ports
RS485_1_N (bidir), RS485_1_P (bidir), RS485_2_DE (in), RS485_2_N (bidir), RS485_2_P (bidir), RS485_2_RE (in), UART3_RX (out), UART3_TX (in), UART4_RX (out), UART4_TX (in)

### Nets
3V3: C60.1 C61.1 C62.1 C63.1 IC15.8(VCC) IC16.8(VCC) R14.2 R16.2  [project net PDR_ON]
GND: C60.2 C61.2 C62.2 C63.2 D1.1 D2.1 D3.1 D4.1 IC15.5(GND) IC16.5(GND) R13.2 R17.2  [project net VSS]
RS485_1_N: D1.2 IC15.6(A) R12.2 ; port RS485_1_N
RS485_1_P: D2.2 IC15.7(B) R12.1 ; port RS485_1_P
RS485_2_DE: IC16.3(DE) R17.1 ; port RS485_2_DE
RS485_2_N: D3.2 IC16.6(A) R15.2 ; port RS485_2_N
RS485_2_P: D4.2 IC16.7(B) R15.1 ; port RS485_2_P
RS485_2_RE: IC16.2(~{RE}) R16.1 ; port RS485_2_RE
UART3_RX: IC16.1(R) ; port UART3_RX
UART3_TX: IC16.4(D) ; port UART3_TX
UART4_RX: IC15.1(R) ; port UART4_RX
UART4_TX: IC15.4(D) ; port UART4_TX
NetIC15_2: IC15.2(~{RE}) R13.1
NetIC15_3: IC15.3(DE) R14.1

### Layout directives
differential pair: RS485_1_N, RS485_1_P, RS485_2_N, RS485_2_P

### Library data of the parts
C60 C62 = C0603C104M4RAC7867: as C2 on sheet MCU; Datasheet Link: https://www.arrow.com/en/products/c0603c104m4rac7867/kemet-corporation?region=nac; Height: 0.95mm; Manufacturer_Part_Number: C0603C104M4RAC7867; Mouser Part Number: N/A; Mouser Price/Stock: https://www.mouser.co.uk/ProductDetail/KEMET/C0603C104M4RAC7867?qs=nAEW9fCjKd%252BI998RVtZhZQ%3D%3D; Arrow Part Number: C0603C104M4RAC7867; Arrow Price/Stock: https://www.arrow.com/en/products/c0603c104m4rac7867/kemet-corporation?region=europe
C61 C63 = C0603C103KMRECAUTO: as C33 on sheet CAN; Datasheet Link: https://content.kemet.com/datasheets/KEM_C1090_X7R_ESD.pdf; Height: 0.87mm; Manufacturer_Part_Number: C0603C103KMRECAUTO; Mouser Part Number: 80-C0603C103KMREAUTO; Mouser Price/Stock: https://www.mouser.co.uk/ProductDetail/KEMET/C0603C103KMRECAUTO?qs=u4fy%2FsgLU9P0r6p3bzZgfw%3D%3D; Arrow Part Number: C0603C103KMRECAUTO; Arrow Price/Stock: https://www.arrow.com/en/products/c0603c103kmrecauto/kemet-corporation?region=nac
D1-D4 = SMAJ30CA: 48.4V Clamp 8.3A Ipp Tvs Diode Surface Mount DO-214AC (SMA); Manufacturer_Name: LITTELFUSE; Datasheet Link: https://www.mouser.se/datasheet/2/240/Littelfuse_TVS_Diode_SMAJ_Datasheet.pdf-540740.pdf; Height: 2.29mm; Manufacturer_Part_Number: SMAJ30CA; Mouser Part Number: 576-SMAJ30CA; Mouser Price/Stock: https://www.mouser.co.uk/ProductDetail/Littelfuse/SMAJ30CA?qs=HR2RnyOI4E7JQai5qAA1IA%3D%3D; Arrow Part Number: SMAJ30CA; Arrow Price/Stock: https://www.arrow.com/en/products/smaj30ca/littelfuse?region=nac
IC15 IC16 = THVD2450DR: 1/1 Transceiver Half RS485 8-SOIC; Manufacturer_Name: Texas Instruments; Datasheet Link: http://www.ti.com/lit/gpn/THVD2450; Height: 1.75mm; Manufacturer_Part_Number: THVD2450DR; Mouser Part Number: 595-THVD2450DR; Mouser Price/Stock: https://www.mouser.co.uk/ProductDetail/Texas-Instruments/THVD2450DR?qs=%252B6g0mu59x7KnRZ8zf%2FOjqQ%3D%3D; Arrow Part Number: THVD2450DR; Arrow Price/Stock: https://www.arrow.com/en/products/thvd2450dr/texas-instruments?region=nac
R12 R15 = ERA-6VEB1200V: as R10 on sheet CAN; Datasheet Link: http://industrial.panasonic.com/cdbs/www-data/pdf/RDM0000/RDM0000C331.pdf; Height: 0.65mm; Manufacturer_Part_Number: ERA-6VEB1200V; Mouser Part Number: 667-ERA-6VEB1200V; Mouser Price/Stock: https://www.mouser.co.uk/ProductDetail/Panasonic/ERA-6VEB1200V?qs=rI7uf1IzohQDwVDMjI%252BQDA%3D%3D; Arrow Part Number: ERA-6VEB1200V; Arrow Price/Stock: https://www.arrow.com/en/products/era-6veb1200v/panasonic?region=nac
R13 R14 R16 R17 = RNCP0603FTD10K0: as R1 on sheet MCU; Datasheet Link: https://cs.seielect.com/catalog/SEI-RNCP.pdf; Height: 0.5mm; Manufacturer_Part_Number: RNCP0603FTD10K0; Mouser Part Number: 708-RNCP0603FTD10K0; Mouser Price/Stock: https://www.mouser.co.uk/ProductDetail/SEI-Stackpole/RNCP0603FTD10K0?qs=FESYatJ8odL1jmHQSpKOPg%3D%3D; Arrow Part Number: RNCP0603FTD10K0; Arrow Price/Stock: https://www.arrow.com/en/products/rncp0603ftd10k0/stackpole-electronics?region=nac

## Sheet MemoryStorage.SchDoc
size A4; SheetNumber: 7; SheetTotal: 12
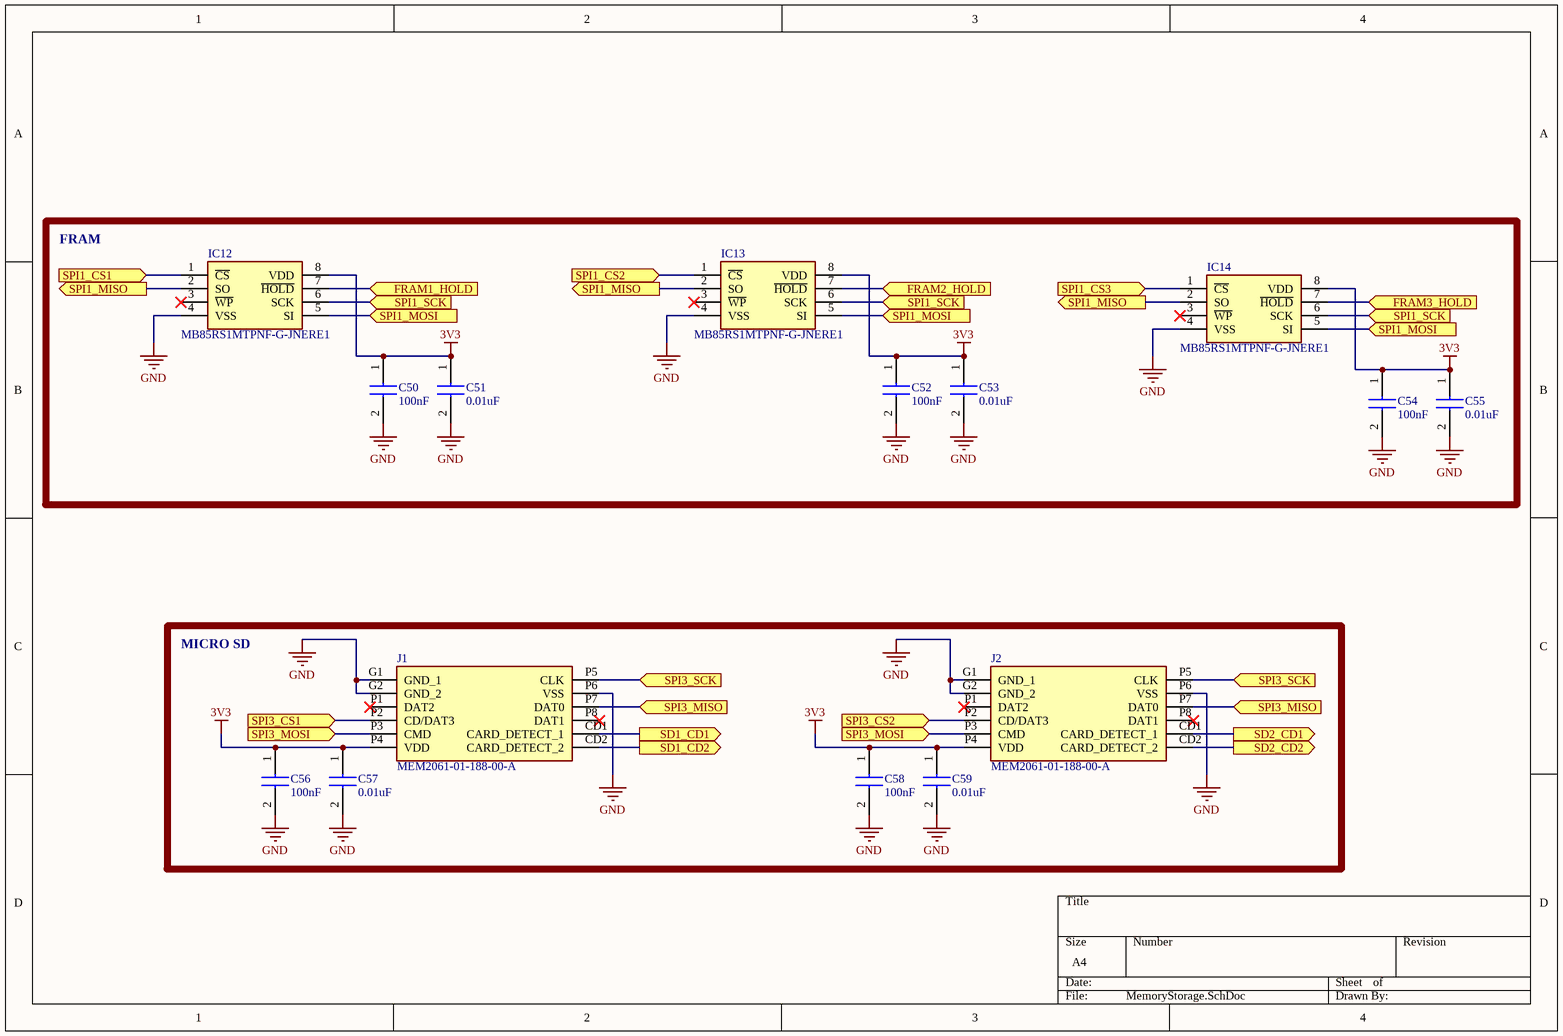
[diagram p5: MemoryStorage.SchDoc]

### Parts
C50  100nF  [CAPC1608X95N]
C51  0.01uF  [C0603]
C52  100nF  [CAPC1608X95N]
C53  0.01uF  [C0603]
C54  100nF  [CAPC1608X95N]
C55  0.01uF  [C0603]
C56  100nF  [CAPC1608X95N]
C57  0.01uF  [C0603]
C58  100nF  [CAPC1608X95N]
C59  0.01uF  [C0603]
IC12  MB85RS1MTPNF-G-JNERE1  [SOIC127P600X175-8N]
IC13  MB85RS1MTPNF-G-JNERE1  [SOIC127P600X175-8N]
IC14  MB85RS1MTPNF-G-JNERE1  [SOIC127P600X175-8N]
J1  MEM2061-01-188-00-A  [MEM20610118800A]
J2  MEM2061-01-188-00-A  [MEM20610118800A]

### Blocks framed on the sheet
FRAM: C50-C55 IC12-IC14
MICRO SD: C56-C59 J1 J2

### Ports
FRAM1_HOLD (in), FRAM2_HOLD (in), FRAM3_HOLD (in), SD1_CD1 (out), SD1_CD2 (out), SD2_CD1 (out), SD2_CD2 (out), SPI1_CS1 (in), SPI1_CS2 (in), SPI1_CS3 (in), SPI1_MISO (out), SPI1_MOSI (in), SPI1_SCK (in), SPI3_CS1 (in), SPI3_CS2 (in), SPI3_MISO (in), SPI3_MOSI (in), SPI3_SCK (in)

### Nets
3V3: C50.1 C51.1 C52.1 C53.1 C54.1 C55.1 C56.1 C57.1 C58.1 C59.1 IC12.8(VDD) IC13.8(VDD) IC14.8(VDD) J1.P4(VDD) J2.P4(VDD)  [project net PDR_ON]
GND: C50.2 C51.2 C52.2 C53.2 C54.2 C55.2 C56.2 C57.2 C58.2 C59.2 IC12.4(VSS) IC13.4(VSS) IC14.4(VSS) J1.G1(GND_1) J1.G2(GND_2) J1.P6(VSS) J2.G1(GND_1) J2.G2(GND_2) J2.P6(VSS)  [project net VSS]
FRAM1_HOLD: IC12.7(~{HOLD}) ; port FRAM1_HOLD
FRAM2_HOLD: IC13.7(~{HOLD}) ; port FRAM2_HOLD
FRAM3_HOLD: IC14.7(~{HOLD}) ; port FRAM3_HOLD
SD1_CD1: J1.CD1(CARD_DETECT_1) ; port SD1_CD1
SD1_CD2: J1.CD2(CARD_DETECT_2) ; port SD1_CD2
SD2_CD1: J2.CD1(CARD_DETECT_1) ; port SD2_CD1
SD2_CD2: J2.CD2(CARD_DETECT_2) ; port SD2_CD2
SPI1_CS1: IC12.1(~{CS}) ; port SPI1_CS1
SPI1_CS2: IC13.1(~{CS}) ; port SPI1_CS2
SPI1_CS3: IC14.1(~{CS}) ; port SPI1_CS3
SPI1_MISO: IC12.2(SO) IC13.2(SO) IC14.2(SO) ; port SPI1_MISO
SPI1_MOSI: IC12.5(SI) IC13.5(SI) IC14.5(SI) ; port SPI1_MOSI
SPI1_SCK: IC12.6(SCK) IC13.6(SCK) IC14.6(SCK) ; port SPI1_SCK
SPI3_CS1: J1.P2(CD/DAT3) ; port SPI3_CS1
SPI3_CS2: J2.P2(CD/DAT3) ; port SPI3_CS2
SPI3_MISO: J1.P7(DAT0) J2.P7(DAT0) ; port SPI3_MISO
SPI3_MOSI: J1.P3(CMD) J2.P3(CMD) ; port SPI3_MOSI
SPI3_SCK: J1.P5(CLK) J2.P5(CLK) ; port SPI3_SCK

Not connected (* = marked no-connect by the designer): IC12 3(~{WP})*; IC13 3(~{WP})*; IC14 3(~{WP})*; J1 P1(DAT2)* P8(DAT1)*; J2 P1(DAT2)* P8(DAT1)*

### Library data of the parts
C50 C52 C54 C56 C58 = C0603C104M4RAC7867: as C2 on sheet MCU; Datasheet Link: https://www.arrow.com/en/products/c0603c104m4rac7867/kemet-corporation?region=nac; Height: 0.95mm; Manufacturer_Part_Number: C0603C104M4RAC7867; Mouser Part Number: N/A; Mouser Price/Stock: https://www.mouser.co.uk/ProductDetail/KEMET/C0603C104M4RAC7867?qs=nAEW9fCjKd%252BI998RVtZhZQ%3D%3D; Arrow Part Number: C0603C104M4RAC7867; Arrow Price/Stock: https://www.arrow.com/en/products/c0603c104m4rac7867/kemet-corporation?region=europe
C51 C53 C55 C57 C59 = C0603C103KMRECAUTO: as C33 on sheet CAN; Datasheet Link: https://content.kemet.com/datasheets/KEM_C1090_X7R_ESD.pdf; Height: 0.87mm; Manufacturer_Part_Number: C0603C103KMRECAUTO; Mouser Part Number: 80-C0603C103KMREAUTO; Mouser Price/Stock: https://www.mouser.co.uk/ProductDetail/KEMET/C0603C103KMRECAUTO?qs=u4fy%2FsgLU9P0r6p3bzZgfw%3D%3D; Arrow Part Number: C0603C103KMRECAUTO; Arrow Price/Stock: https://www.arrow.com/en/products/c0603c103kmrecauto/kemet-corporation?region=nac
IC12-IC14 = MB85RS1MTPNF-G-JNERE1: FRAM (Ferroelectric RAM) Memory IC 1Mbit SPI 40 MHz 8-SOP; Manufacturer_Name: FUJITSU; Datasheet Link: https://www.fujitsu.com/us/Images/MB85RS1MT-DS501-00022-2v0-E.pdf; Height: 1.75mm; Manufacturer_Part_Number: MB85RS1MTPNF-G-JNERE1; Mouser Part Number: 249-85S1MTPNFGJNERE1; Mouser Price/Stock: https://www.mouser.co.uk/ProductDetail/Fujitsu-Semiconductor/MB85RS1MTPNF-G-JNERE1?qs=HBWAp0VN4Rhzv67G8JdVdQ%3D%3D
J1 J2 = MEM2061-01-188-00-A: MICRO SD PUSH PUSH, CLOSED, SMT,; Manufacturer_Name: GLOBAL CONNECTOR TECHNOLOGY; Datasheet Link: https://gct.co/files/drawings/mem2061.pdf?v=db251ddb-1946-4f24-aa19-b8a17901bdd2; Height: 2.13mm; Manufacturer_Part_Number: MEM2061-01-188-00-A

## Sheet TempSensors.SchDoc
size A4; SheetNumber: 6; SheetTotal: 12
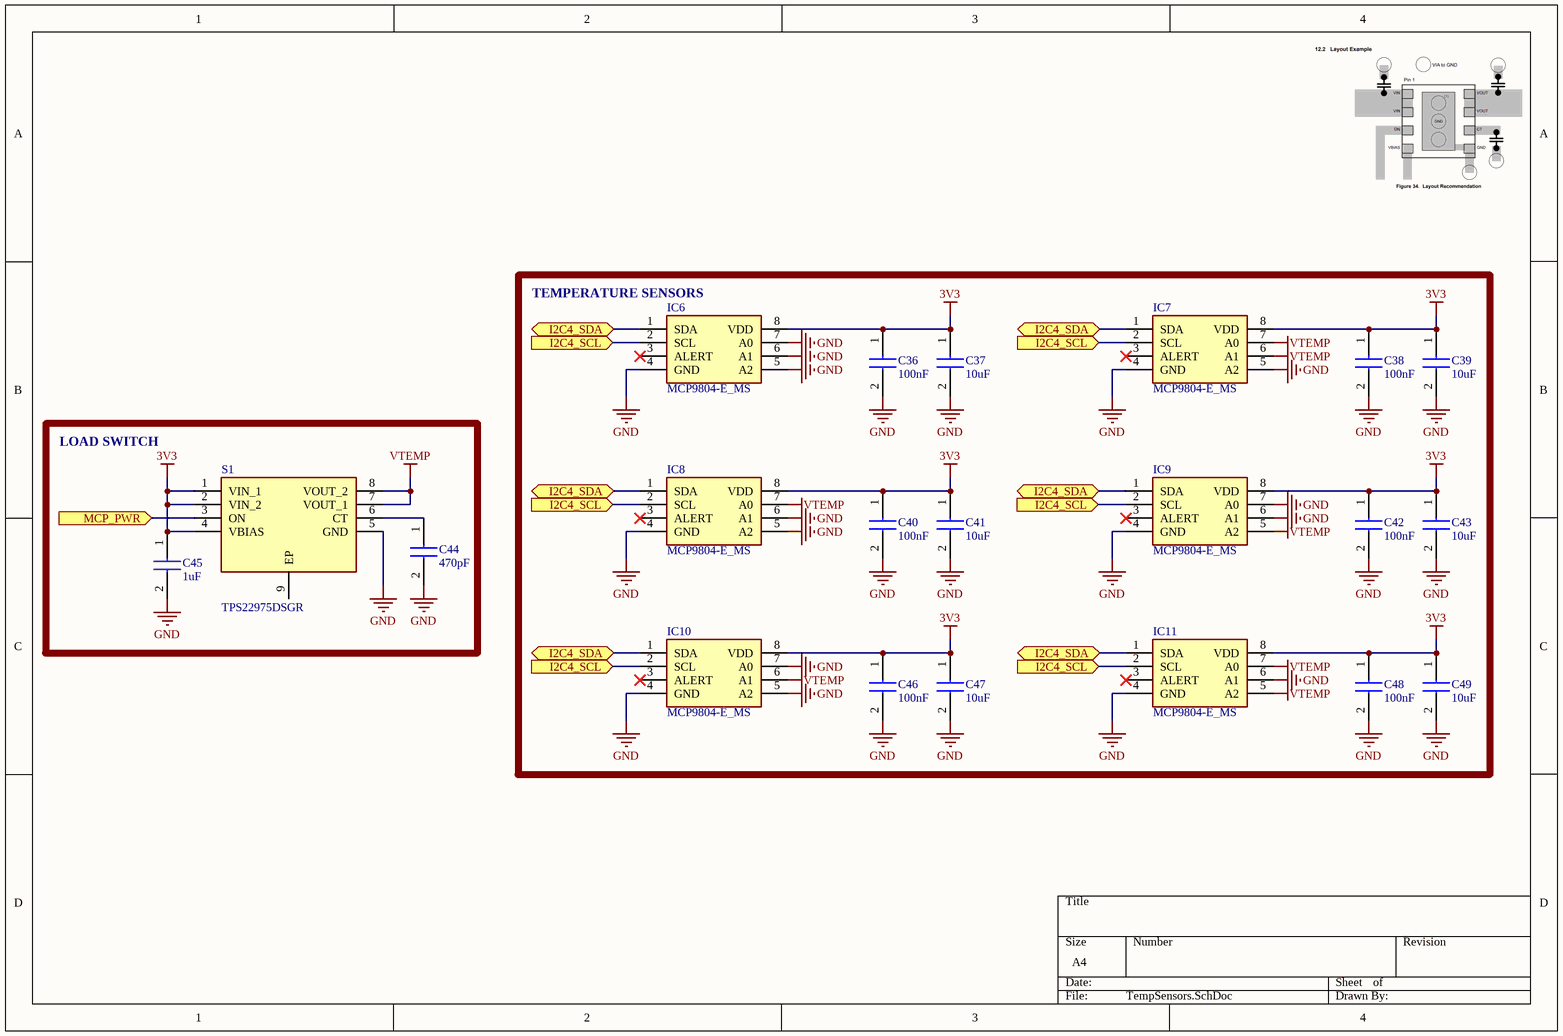
[diagram p6: TempSensors.SchDoc]

### Parts
C36  100nF  [CAPC1608X95N]
C37  10uF  [CAPC1608X90N]
C38  100nF  [CAPC1608X95N]
C39  10uF  [CAPC1608X90N]
C40  100nF  [CAPC1608X95N]
C41  10uF  [CAPC1608X90N]
C42  100nF  [CAPC1608X95N]
C43  10uF  [CAPC1608X90N]
C44  470pF  [CAPC1608X87N]
C45  1uF  [CAPC1608X90N]
C46  100nF  [CAPC1608X95N]
C47  10uF  [CAPC1608X90N]
C48  100nF  [CAPC1608X95N]
C49  10uF  [CAPC1608X90N]
IC6  MCP9804-E_MS  [SOP65P490X110-8N]
IC7  MCP9804-E_MS  [SOP65P490X110-8N]
IC8  MCP9804-E_MS  [SOP65P490X110-8N]
IC9  MCP9804-E_MS  [SOP65P490X110-8N]
IC10  MCP9804-E_MS  [SOP65P490X110-8N]
IC11  MCP9804-E_MS  [SOP65P490X110-8N]
S1  TPS22975DSGR  [SON50P200X200X80-9N]

### Blocks framed on the sheet
TEMPERATURE SENSORS: C36-C43 C46-C49 IC6-IC11
LOAD SWITCH: C44 C45 S1

### Ports
I2C4_SCL (in), I2C4_SDA (bidir), MCP_PWR (in)

### Nets
3V3: C36.1 C37.1 C38.1 C39.1 C40.1 C41.1 C42.1 C43.1 C45.1 C46.1 C47.1 C48.1 C49.1 IC6.8(VDD) IC7.8(VDD) IC8.8(VDD) IC9.8(VDD) IC10.8(VDD) IC11.8(VDD) S1.1(VIN_1) S1.2(VIN_2) S1.4(VBIAS)  [project net PDR_ON]
GND: C36.2 C37.2 C38.2 C39.2 C40.2 C41.2 C42.2 C43.2 C44.2 C45.2 C46.2 C47.2 C48.2 C49.2 IC6.4(GND) IC6.5(A2) IC6.6(A1) IC6.7(A0) IC7.4(GND) IC7.5(A2) IC8.4(GND) IC8.5(A2) IC8.6(A1) IC9.4(GND) IC9.6(A1) IC9.7(A0) IC10.4(GND) IC10.5(A2) IC10.7(A0) IC11.4(GND) IC11.6(A1) S1.5(GND)  [project net VSS]
VTEMP: IC7.6(A1) IC7.7(A0) IC8.7(A0) IC9.5(A2) IC10.6(A1) IC11.5(A2) IC11.7(A0) S1.7(VOUT_1) S1.8(VOUT_2)
I2C4_SCL: IC6.2(SCL) IC7.2(SCL) IC8.2(SCL) IC10.2(SCL) IC11.2(SCL) ; port I2C4_SCL
I2C4_SDA: IC6.1(SDA) IC7.1(SDA) IC8.1(SDA) IC10.1(SDA) IC11.1(SDA) ; port I2C4_SDA
MCP_PWR: S1.3(ON) ; port MCP_PWR
NetC44_1: C44.1 S1.6(CT)

Not connected (* = marked no-connect by the designer): IC6 3(ALERT)*; IC7 3(ALERT)*; IC8 3(ALERT)*; IC9 1(SDA) 2(SCL) 3(ALERT)*; IC10 3(ALERT)*; IC11 3(ALERT)*; S1 9(EP)

### Library data of the parts
C36 C38 C40 C42 C46 C48 = C0603C104M4RAC7867: as C2 on sheet MCU; Datasheet Link: https://www.arrow.com/en/products/c0603c104m4rac7867/kemet-corporation?region=nac; Height: 0.95mm; Manufacturer_Part_Number: C0603C104M4RAC7867; Mouser Part Number: N/A; Mouser Price/Stock: https://www.mouser.co.uk/ProductDetail/KEMET/C0603C104M4RAC7867?qs=nAEW9fCjKd%252BI998RVtZhZQ%3D%3D; Arrow Part Number: C0603C104M4RAC7867; Arrow Price/Stock: https://www.arrow.com/en/products/c0603c104m4rac7867/kemet-corporation?region=europe
C37 C39 C41 C43 C47 C49 = GRM188D71A106KA73D: CAP CER 10UF 10V X7T 0603; Manufacturer_Name: Murata Electronics; Datasheet Link: https://psearch.en.murata.com/capacitor/product/GRM188D71A106KA73%23.html; Height: 0.9mm; Manufacturer_Part_Number: GRM188D71A106KA73D; Mouser Part Number: 81-GRM188D71A106KA3D; Mouser Price/Stock: https://www.mouser.co.uk/ProductDetail/Murata-Electronics/GRM188D71A106KA73D?qs=FvQ4nYu%252B2He2GIhYKxXmMQ%3D%3D; Arrow Part Number: GRM188D71A106KA73D; Arrow Price/Stock: https://www.arrow.com/en/products/grm188d71a106ka73d/murata-manufacturing?region=nac
C44 = 0603B471K500CT: CAP CER 470PF 50V X7R 0603; Manufacturer_Name: Walsin Technology Corporation; Datasheet Link: https://g.componentsearchengine.com/Datasheets/2/0603B471K500CT.pdf; Height: 0.87mm; Manufacturer_Part_Number: 0603B471K500CT; Arrow Part Number: 0603B471K500CT; Arrow Price/Stock: https://www.arrow.com/en/products/0603b471k500ct/walsin-technology
C45 = CL10A105KA8NNNC: as C13 on sheet MCU; Datasheet Link: http://uk.rs-online.com/web/p/products/7664838; Height: 0.9mm; Manufacturer_Part_Number: CL10A105KA8NNNC; Mouser Part Number: 187-CL10A105KA8NNNC; Mouser Price/Stock: https://www.mouser.co.uk/ProductDetail/Samsung-Electro-Mechanics/CL10A105KA8NNNC?qs=hqM3L16%252BxldY%252BnK4KzDJVg%3D%3D; Arrow Part Number: CL10A105KA8NNNC; Arrow Price/Stock: https://www.arrow.com/en/products/cl10a105ka8nnnc/samsung-electro-mechanics?region=europe
IC6-IC11 = MCP9804-E_MS: Temperature Sensor Digital, Local -40°C ~ 125°C 10 b 8-MSOP; Manufacturer_Name: Microchip; Manufacturer_Part_Number: MCP9804-E/MS; Datasheet Link: http://ww1.microchip.com/downloads/en/DeviceDoc/22203C.pdf; Height: 1.1mm; Mouser Part Number: 579-MCP9804-E/MS; Mouser Price/Stock: https://www.mouser.co.uk/ProductDetail/Microchip-Technology-Atmel/MCP9804-E-MS?qs=AzWaBQTUlgwto0lQwcuMoQ%3D%3D; Arrow Part Number: MCP9804-E/MS; Arrow Price/Stock: https://www.arrow.com/en/products/mcp9804-ems/microchip-technology?region=nac
S1 = TPS22975DSGR: Power Switch/Driver 1:1 N-Channel 6A 8-WSON (2x2); Manufacturer_Name: Texas Instruments; Datasheet Link: http://www.ti.com/lit/gpn/tps22975; Height: 0.8mm; Manufacturer_Part_Number: TPS22975DSGR; Mouser Part Number: 595-TPS22975DSGR; Mouser Price/Stock: https://www.mouser.co.uk/ProductDetail/Texas-Instruments/TPS22975DSGR?qs=zEmsApcVOkXVZ0HZtWdfyQ%3D%3D; Arrow Part Number: TPS22975DSGR; Arrow Price/Stock: https://www.arrow.com/en/products/tps22975dsgr/texas-instruments?region=nac

## Sheet ExternalConnectors.SchDoc
size A4; SheetNumber: 8; SheetTotal: 12
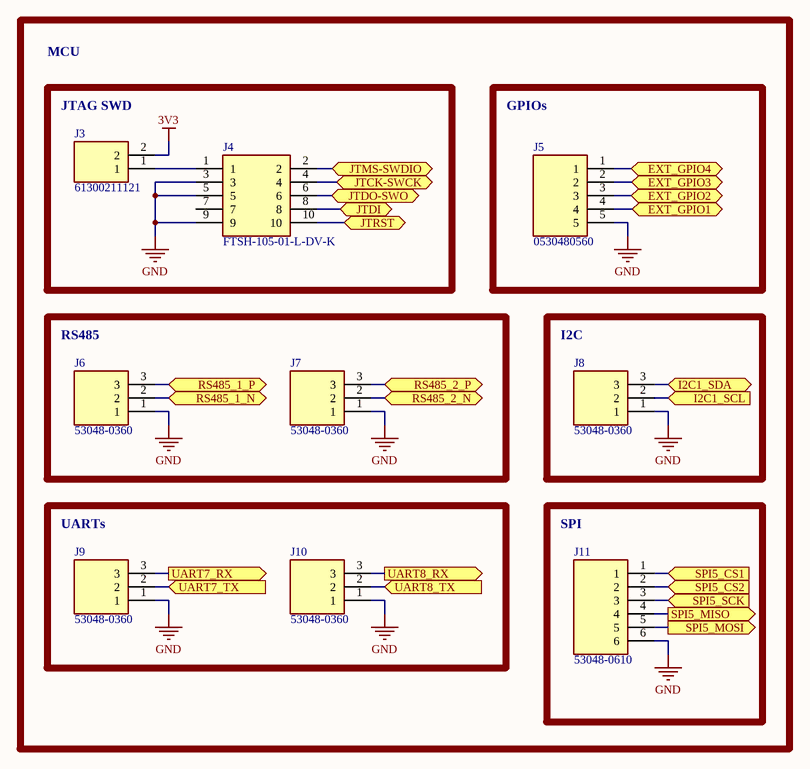
[diagram p7: ExternalConnectors.SchDoc]

### Parts
J3  61300211121  [HDRV2W110P0X254_1X2_508X254X854P]
J4  FTSH-105-01-L-DV-K  [FTSH10501LDVK]
J5  0530480560  [530480510]
J6  53048-0360  [SHDRRA3W35P0X125_1X3_550X550X350P]
J7  53048-0360  [SHDRRA3W35P0X125_1X3_550X550X350P]
J8  53048-0360  [SHDRRA3W35P0X125_1X3_550X550X350P]
J9  53048-0360  [SHDRRA3W35P0X125_1X3_550X550X350P]
J10  53048-0360  [SHDRRA3W35P0X125_1X3_550X550X350P]
J11  53048-0610  [530480610]

### Blocks framed on the sheet
JTAG SWD: J3 J4
GPIOs: J5
RS485: J6 J7
I2C: J8
UARTs: J9 J10
SPI: J11

### Ports
EXT_GPIO1 (bidir), EXT_GPIO2 (bidir), EXT_GPIO3 (bidir), EXT_GPIO4 (bidir), I2C1_SCL (in), I2C1_SDA (bidir), JTCK-SWCK (bidir), JTDI (bidir), JTDO-SWO (bidir), JTMS-SWDIO (bidir), JTRST (bidir), RS485_1_N (bidir), RS485_1_P (bidir), RS485_2_N (bidir), RS485_2_P (bidir), SPI5_CS1 (in), SPI5_CS2 (in), SPI5_MISO (out), SPI5_MOSI (out), SPI5_SCK (in), UART7_RX (out), UART7_TX (in), UART8_RX (out), UART8_TX (in)

### Nets
3V3: J3.2  [project net PDR_ON]
GND: J4.3 J4.5 J4.9 J5.5 J6.1 J7.1 J8.1 J9.1 J10.1 J11.6  [project net VSS]
EXT_GPIO1: J5.4 ; port EXT_GPIO1
EXT_GPIO2: J5.3 ; port EXT_GPIO2
EXT_GPIO3: J5.2 ; port EXT_GPIO3
EXT_GPIO4: J5.1 ; port EXT_GPIO4
I2C1_SCL: J8.2 ; port I2C1_SCL
I2C1_SDA: J8.3 ; port I2C1_SDA
JRST: J4.10 ; port JTRST
JTCK-SWCLK: J4.4 ; port JTCK-SWCK
JTDI: J4.8 ; port JTDI
JTDO-SWO: J4.6 ; port JTDO-SWO
JTMS-SWDIO: J4.2 ; port JTMS-SWDIO
RS485_1_N: J6.2 ; port RS485_1_N
RS485_1_P: J6.3 ; port RS485_1_P
RS485_2_N: J7.2 ; port RS485_2_N
RS485_2_P: J7.3 ; port RS485_2_P
SPI5_CS1: J11.1 ; port SPI5_CS1
SPI5_CS2: J11.2 ; port SPI5_CS2
SPI5_MISO: J11.4 ; port SPI5_MISO
SPI5_MOSI: J11.5 ; port SPI5_MOSI
SPI5_SCK: J11.3 ; port SPI5_SCK
UART7_RX: J9.3 ; port UART7_RX
UART7_TX: J9.2 ; port UART7_TX
UART8_RX: J10.3 ; port UART8_RX
UART8_TX: J10.2 ; port UART8_TX
NetJ3_1: J3.1 J4.1

Not connected (* = marked no-connect by the designer): J4 7

### Notes on the sheet
- MCU

### Library data of the parts
J3 = 61300211121: Connector; Manufacturer_Name: Wurth Elektronik; Datasheet Link: https://componentsearchengine.com/Datasheets/2/61300211121.pdf; Height: 8.54mm; Manufacturer_Part_Number: 61300211121; Mouser Part Number: 710-61300211121; Mouser Price/Stock: https://www.mouser.co.uk/ProductDetail/Wurth-Elektronik/61300211121?qs=t4813l51qx%252B1A5GYDQxPlw%3D%3D
J4 = FTSH-105-01-L-DV-K: Connector Header Surface Mount 10 position 0.050" (1.27mm); pin to pad: 1>10 2>9 3>8 4>7 5>6 6>5 7>4 8>3 9>2 10>1; Manufacturer_Name: SAMTEC; Datasheet Link: https://www.arrow.com/en/products/ftsh-105-01-l-dv-k/samtec; Height: 6.1mm; Manufacturer_Part_Number: FTSH-105-01-L-DV-K; Mouser Part Number: 200-FTSH10501LDVK; Mouser Price/Stock: https://www.mouser.co.uk/ProductDetail/Samtec/FTSH-105-01-L-DV-K?qs=%252B5JSS813miOqo3Vy%252BvhCFg%3D%3D; Arrow Part Number: FTSH-105-01-L-DV-K; Arrow Price/Stock: https://www.arrow.com/en/products/ftsh-105-01-l-dv-k/samtec?region=europe
J5 = 53048-0510: Connector Header Through Hole, Right Angle 5 position 0.049" (1.25mm); Manufacturer_Name: Molex; Datasheet Link: https://componentsearchengine.com/Datasheets/2/53048-0510.pdf; Height: 3.7mm; Manufacturer_Part_Number: 53048-0510; Mouser Part Number: 538-53048-0510; Mouser Price/Stock: https://www.mouser.co.uk/ProductDetail/Molex/53048-0510?qs=nn26K2WaEYvXrn%2FdgEEqtg%3D%3D
J6-J10 = 53048-0310: Connector Header Through Hole, Right Angle 3 position 0.049" (1.25mm); Manufacturer_Name: Molex; Datasheet Link: https://www.molex.com/pdm_docs/sd/530481010_sd.pdf; Height: 3.5mm; Manufacturer_Part_Number: 53048-0310; Mouser Part Number: 538-53048-0310; Mouser Price/Stock: https://www.mouser.co.uk/ProductDetail/Molex/53048-0310?qs=zXrbR4Jv0OfUlEeVnlaifA%3D%3D
J11 = 53048-0610: Connector; Manufacturer_Name: Molex; Datasheet Link: https://www.molex.com/pdm_docs/sd/530480610_sd.pdf; Height: 3.7mm; Manufacturer_Part_Number: 53048-0610; Mouser Part Number: 538-53048-0610; Mouser Price/Stock: https://www.mouser.co.uk/ProductDetail/Molex/53048-0610?qs=4XSMV6Twtb0hBXTOEHM3BQ%3D%3D; Arrow Part Number: 53048-0610; Arrow Price/Stock: https://www.arrow.com/en/products/53048-0610/molex?region=nac

## Sheet BoardConnectors.SchDoc
size A4; SheetNumber: 3; SheetTotal: 12
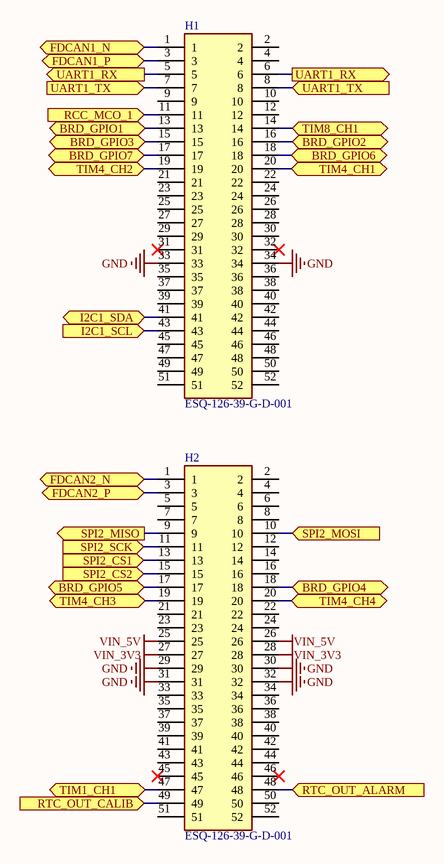
[diagram p8: BoardConnectors.SchDoc]

### Parts
H1  ESQ-126-39-G-D-001  [RHDR52W64P254_2X26_6654X495X1135P]
H2  ESQ-126-39-G-D-001  [RHDR52W64P254_2X26_6654X495X1135P]

### Ports
BRD_GPIO1 (bidir), BRD_GPIO2 (bidir), BRD_GPIO3 (bidir), BRD_GPIO4 (bidir), BRD_GPIO5 (bidir), BRD_GPIO6 (bidir), BRD_GPIO7 (bidir), FDCAN1_N (bidir), FDCAN1_P (bidir), FDCAN2_N (bidir), FDCAN2_P (bidir), I2C1_SCL (in), I2C1_SDA (bidir), RCC_MCO_1 (in), RTC_OUT_ALARM (in), RTC_OUT_CALIB (in), SPI2_CS1 (in), SPI2_CS2 (in), SPI2_MISO (out), SPI2_MOSI (in), SPI2_SCK (in), TIM1_CH1 (bidir), TIM4_CH1 (bidir), TIM4_CH2 (bidir), TIM4_CH3 (bidir), TIM4_CH4 (bidir), TIM8_CH1 (bidir), UART1_RX (out), UART1_TX (in)

### Nets
GND: H1.33 H1.34 H2.29 H2.30 H2.31 H2.32  [project net VSS]
VIN_3V3: H2.27 H2.28
VIN_5V: H2.25 H2.26
BRD_GPIO1: H1.13 ; port BRD_GPIO1
BRD_GPIO2: H1.16 ; port BRD_GPIO2
BRD_GPIO3: H1.15 ; port BRD_GPIO3
BRD_GPIO4: H2.18 ; port BRD_GPIO4
BRD_GPIO5: H2.17 ; port BRD_GPIO5
BRD_GPIO6: H1.18 ; port BRD_GPIO6
BRD_GPIO7: H1.17 ; port BRD_GPIO7
FDCAN1_N: H1.1 ; port FDCAN1_N
FDCAN1_P: H1.3 ; port FDCAN1_P
FDCAN2_N: H2.1 ; port FDCAN2_N
FDCAN2_P: H2.3 ; port FDCAN2_P
I2C1_SCL: H1.43 ; port I2C1_SCL
I2C1_SDA: H1.41 ; port I2C1_SDA
RCC_MCO_1: H1.11 ; port RCC_MCO_1
RTC_OUT_ALARM: H2.48 ; port RTC_OUT_ALARM
RTC_OUT_CALIB: H2.49 ; port RTC_OUT_CALIB
SPI2_CS1: H2.13 ; port SPI2_CS1
SPI2_CS2: H2.15 ; port SPI2_CS2
SPI2_MISO: H2.9 ; port SPI2_MISO
SPI2_MOSI: H2.10 ; port SPI2_MOSI
SPI2_SCK: H2.11 ; port SPI2_SCK
TIM1_CH1: H2.47 ; port TIM1_CH1
TIM4_CH1: H1.20 ; port TIM4_CH1
TIM4_CH2: H1.19 ; port TIM4_CH2
TIM4_CH3: H2.19 ; port TIM4_CH3
TIM4_CH4: H2.20 ; port TIM4_CH4
TIM8_CH1: H1.14 ; port TIM8_CH1
UART1_RX: H1.5 H1.6 ; port UART1_RX
UART1_TX: H1.7 H1.8 ; port UART1_TX

Not connected (* = marked no-connect by the designer): H1 2 4 9 10 12 21 22 23 24 25 26 27 28 29 30 31* 32* 35 36 37 38 39 40 42 44 45 46 47 48 49 50 51 52; H2 2 4 5 6 7 8 12 14 16 21 22 23 24 33 34 35 36 37 38 39 40 41 42 43 44 45* 46* 50 51 52

### Library data of the parts
H1 H2 = ESQ-126-39-G-D-001: 52 Position Elevated Socket Connector 0.100" (2.54mm) Through Hole Gold; Manufacturer_Name: SAMTEC; Datasheet Link: http://suddendocs.samtec.com/catalog_english/esq_th.pdf; Height: 11.35mm; Manufacturer_Part_Number: ESQ-126-39-G-D-001; Mouser Part Number: 200-ESQ12639GD001; Mouser Price/Stock: https://www.mouser.co.uk/ProductDetail/Samtec/ESQ-126-39-G-D-001?qs=PB6%2FjmICvI2K%2FCIgL4SVbg%3D%3D

## Sheet FPGA.SchDoc
size A4; SheetNumber: 11; SheetTotal: 11

## Sheet RF.SchDoc
size A4; SheetNumber: 12; SheetTotal: 12